# EAGLE board control_board (EAGLE 9.6.2)
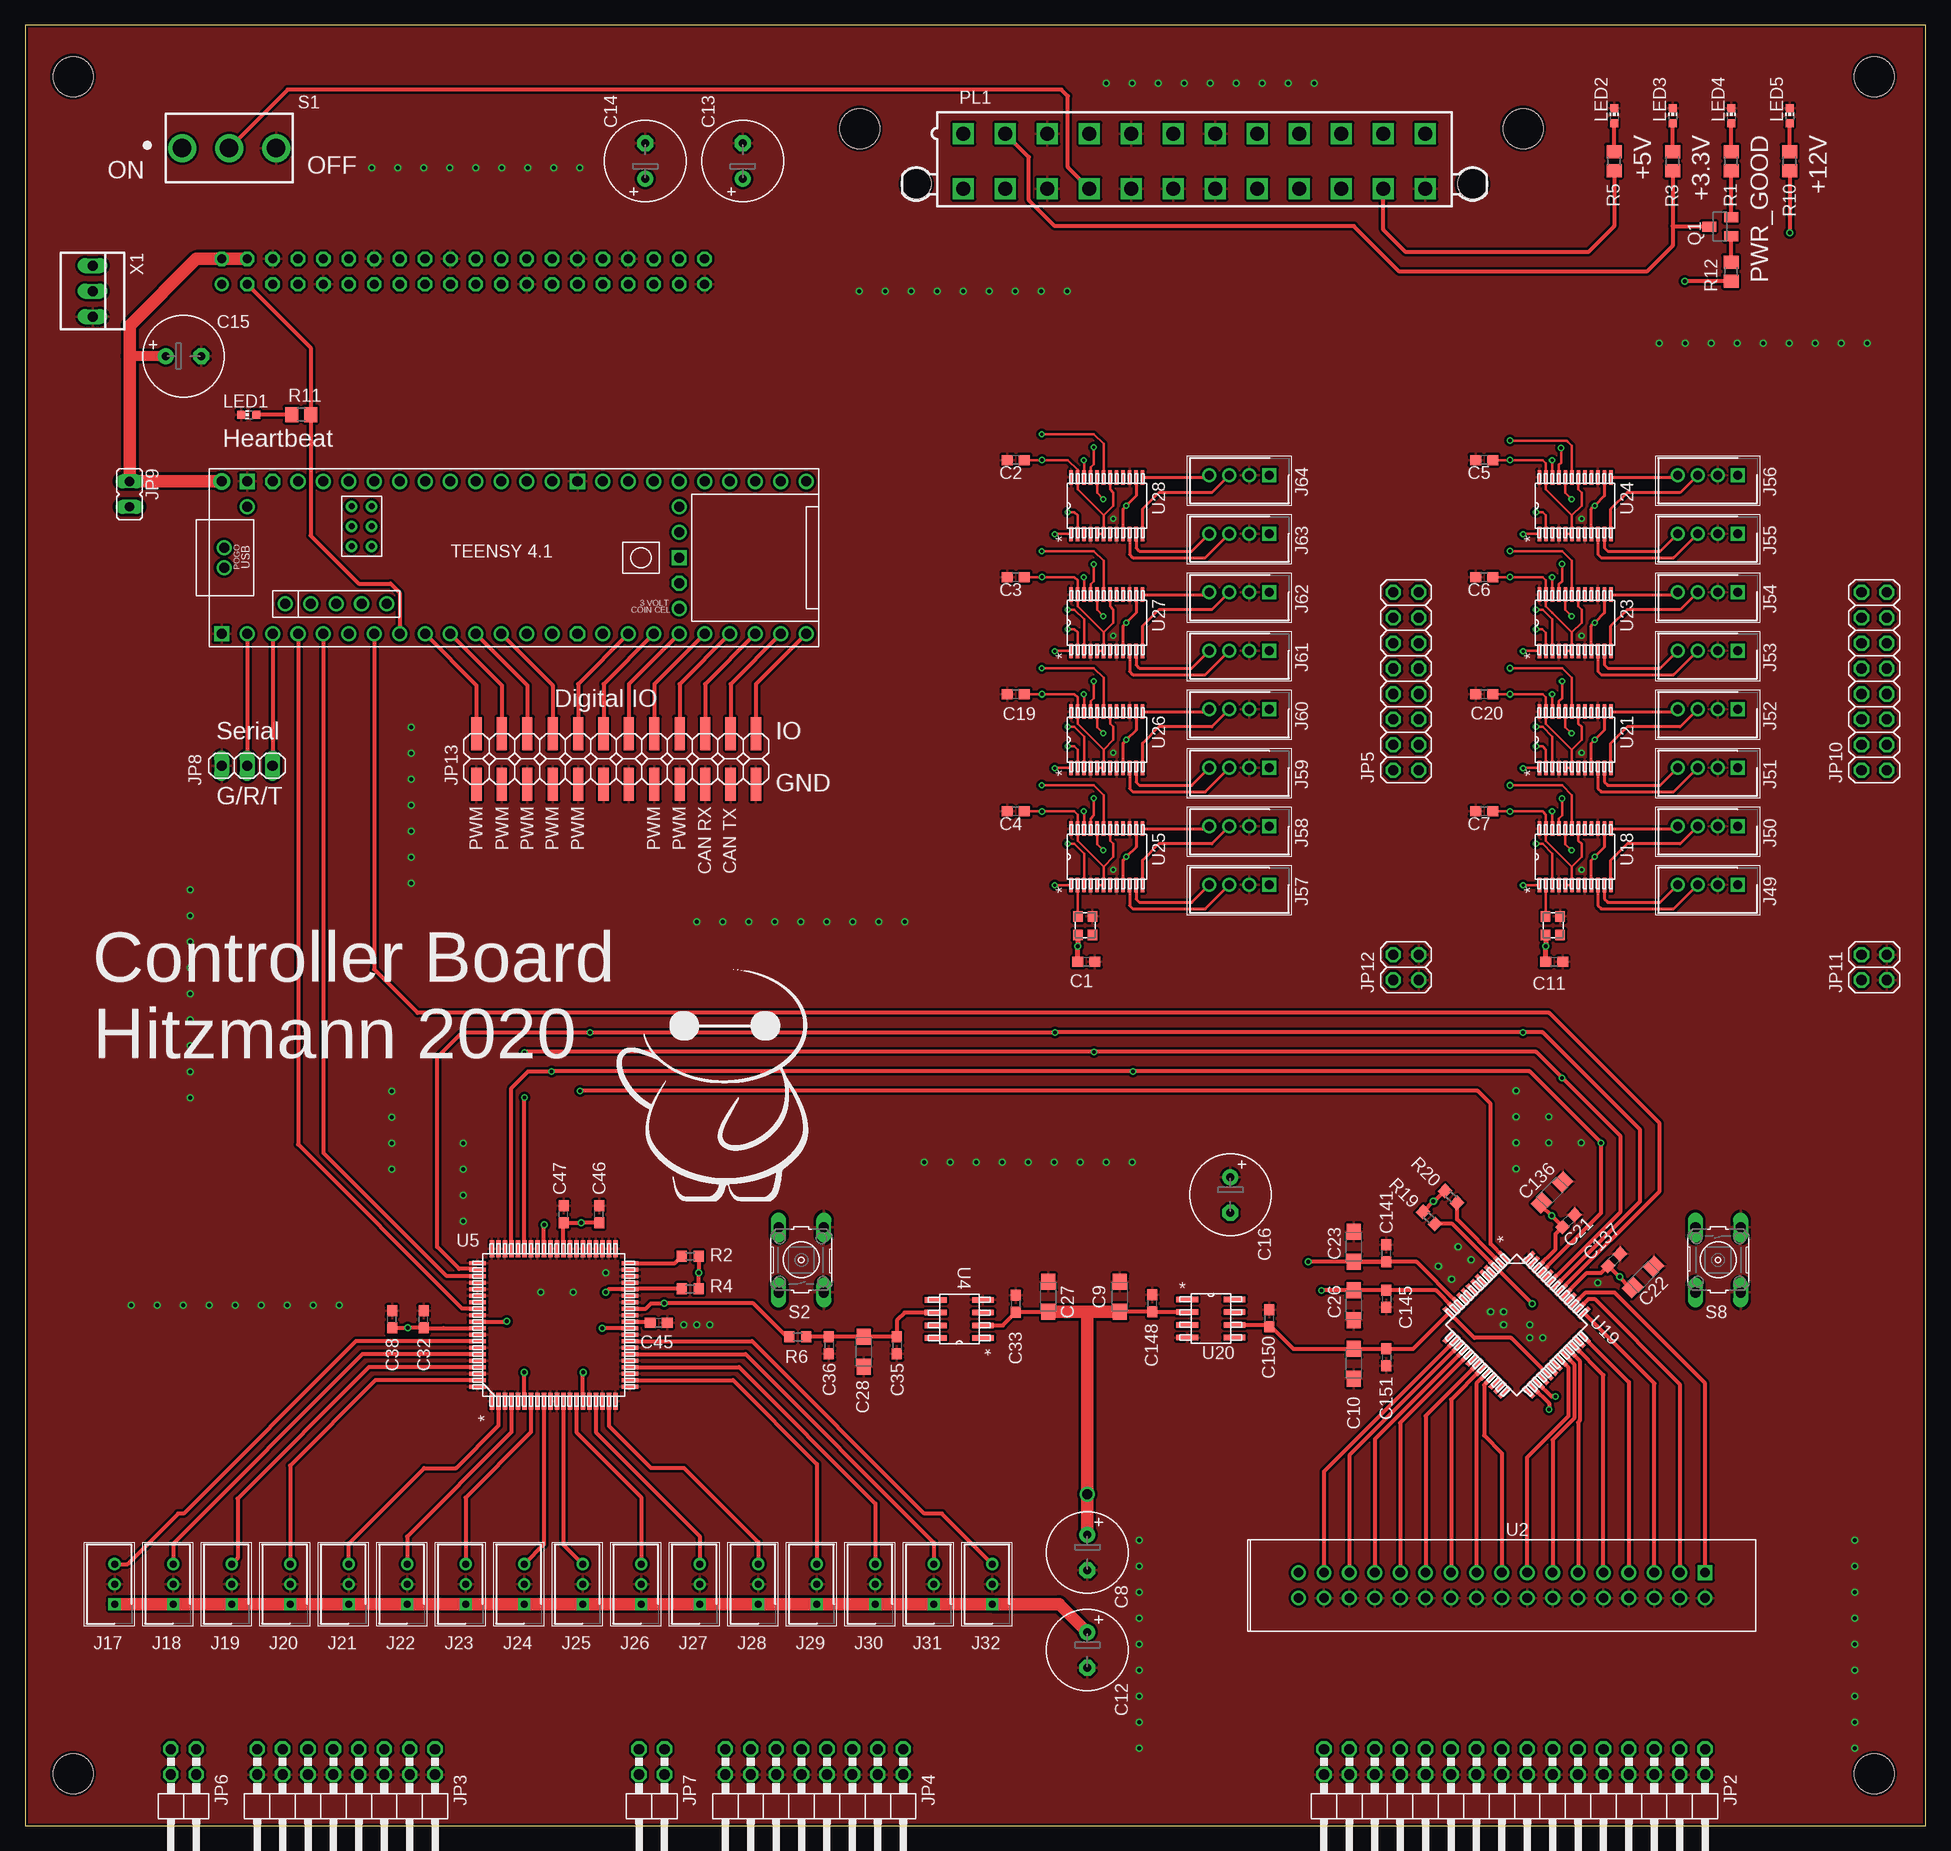
[diagram p6: board, top side]
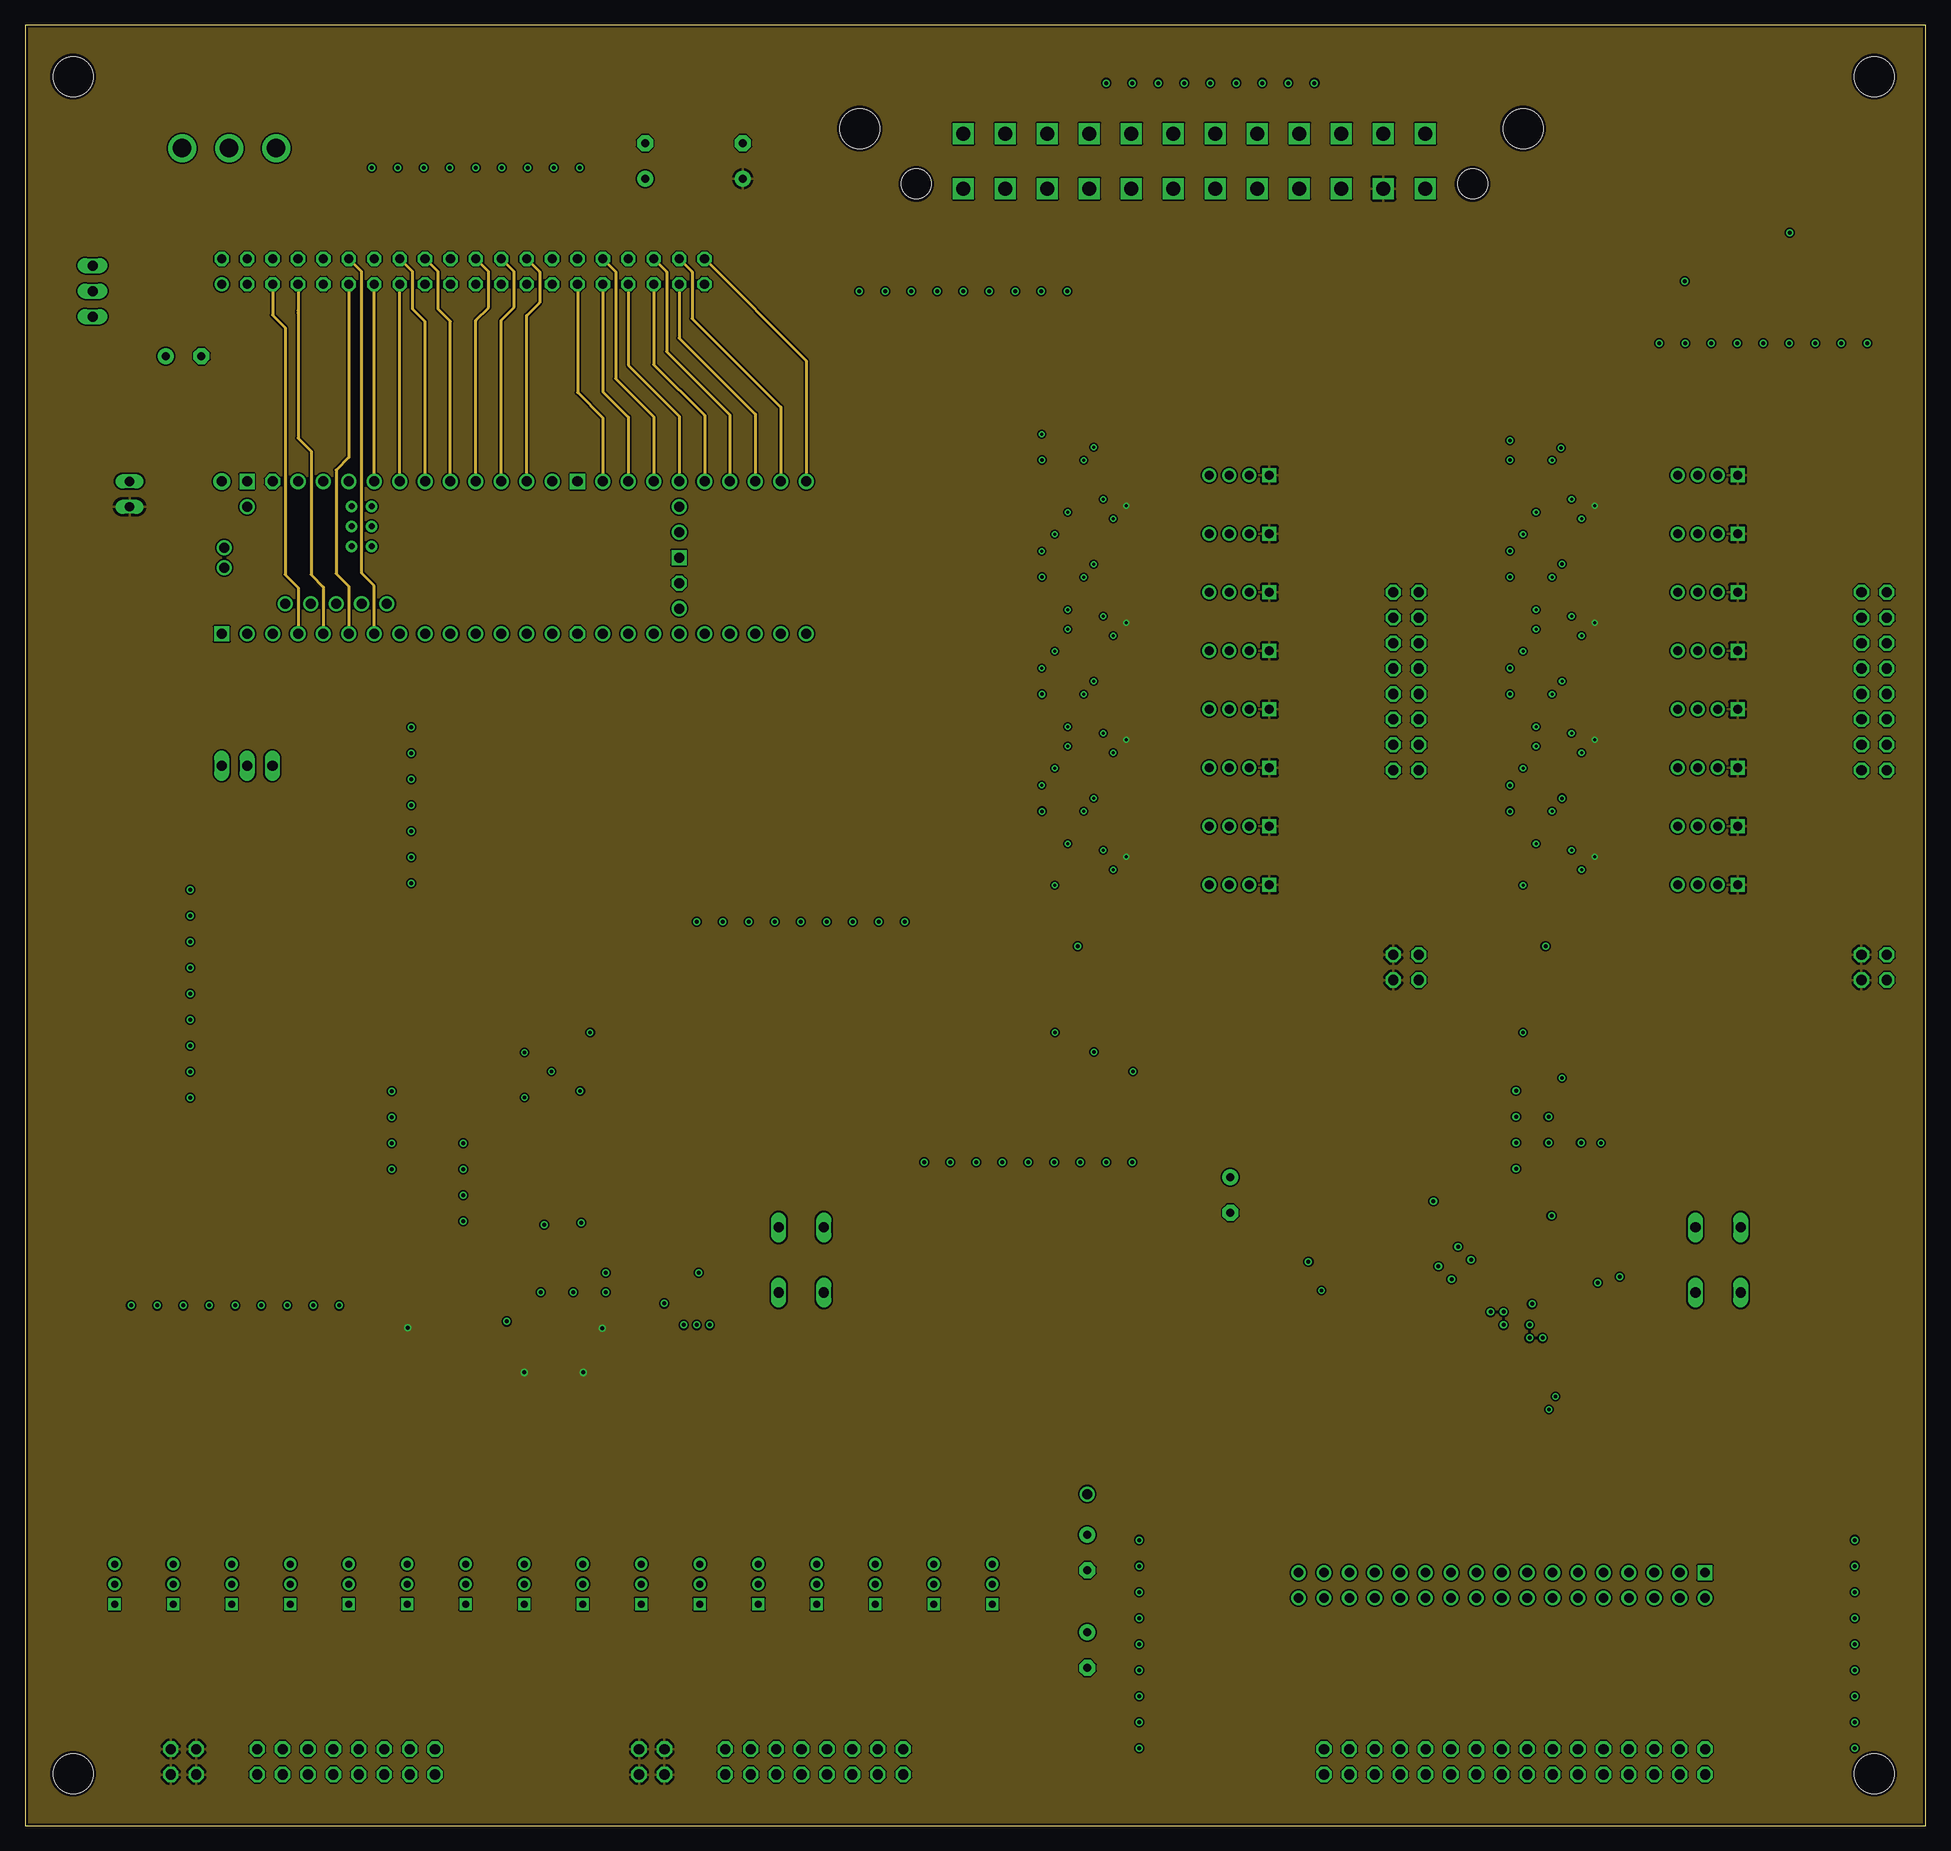
[diagram p7: board, inner layer Route2]
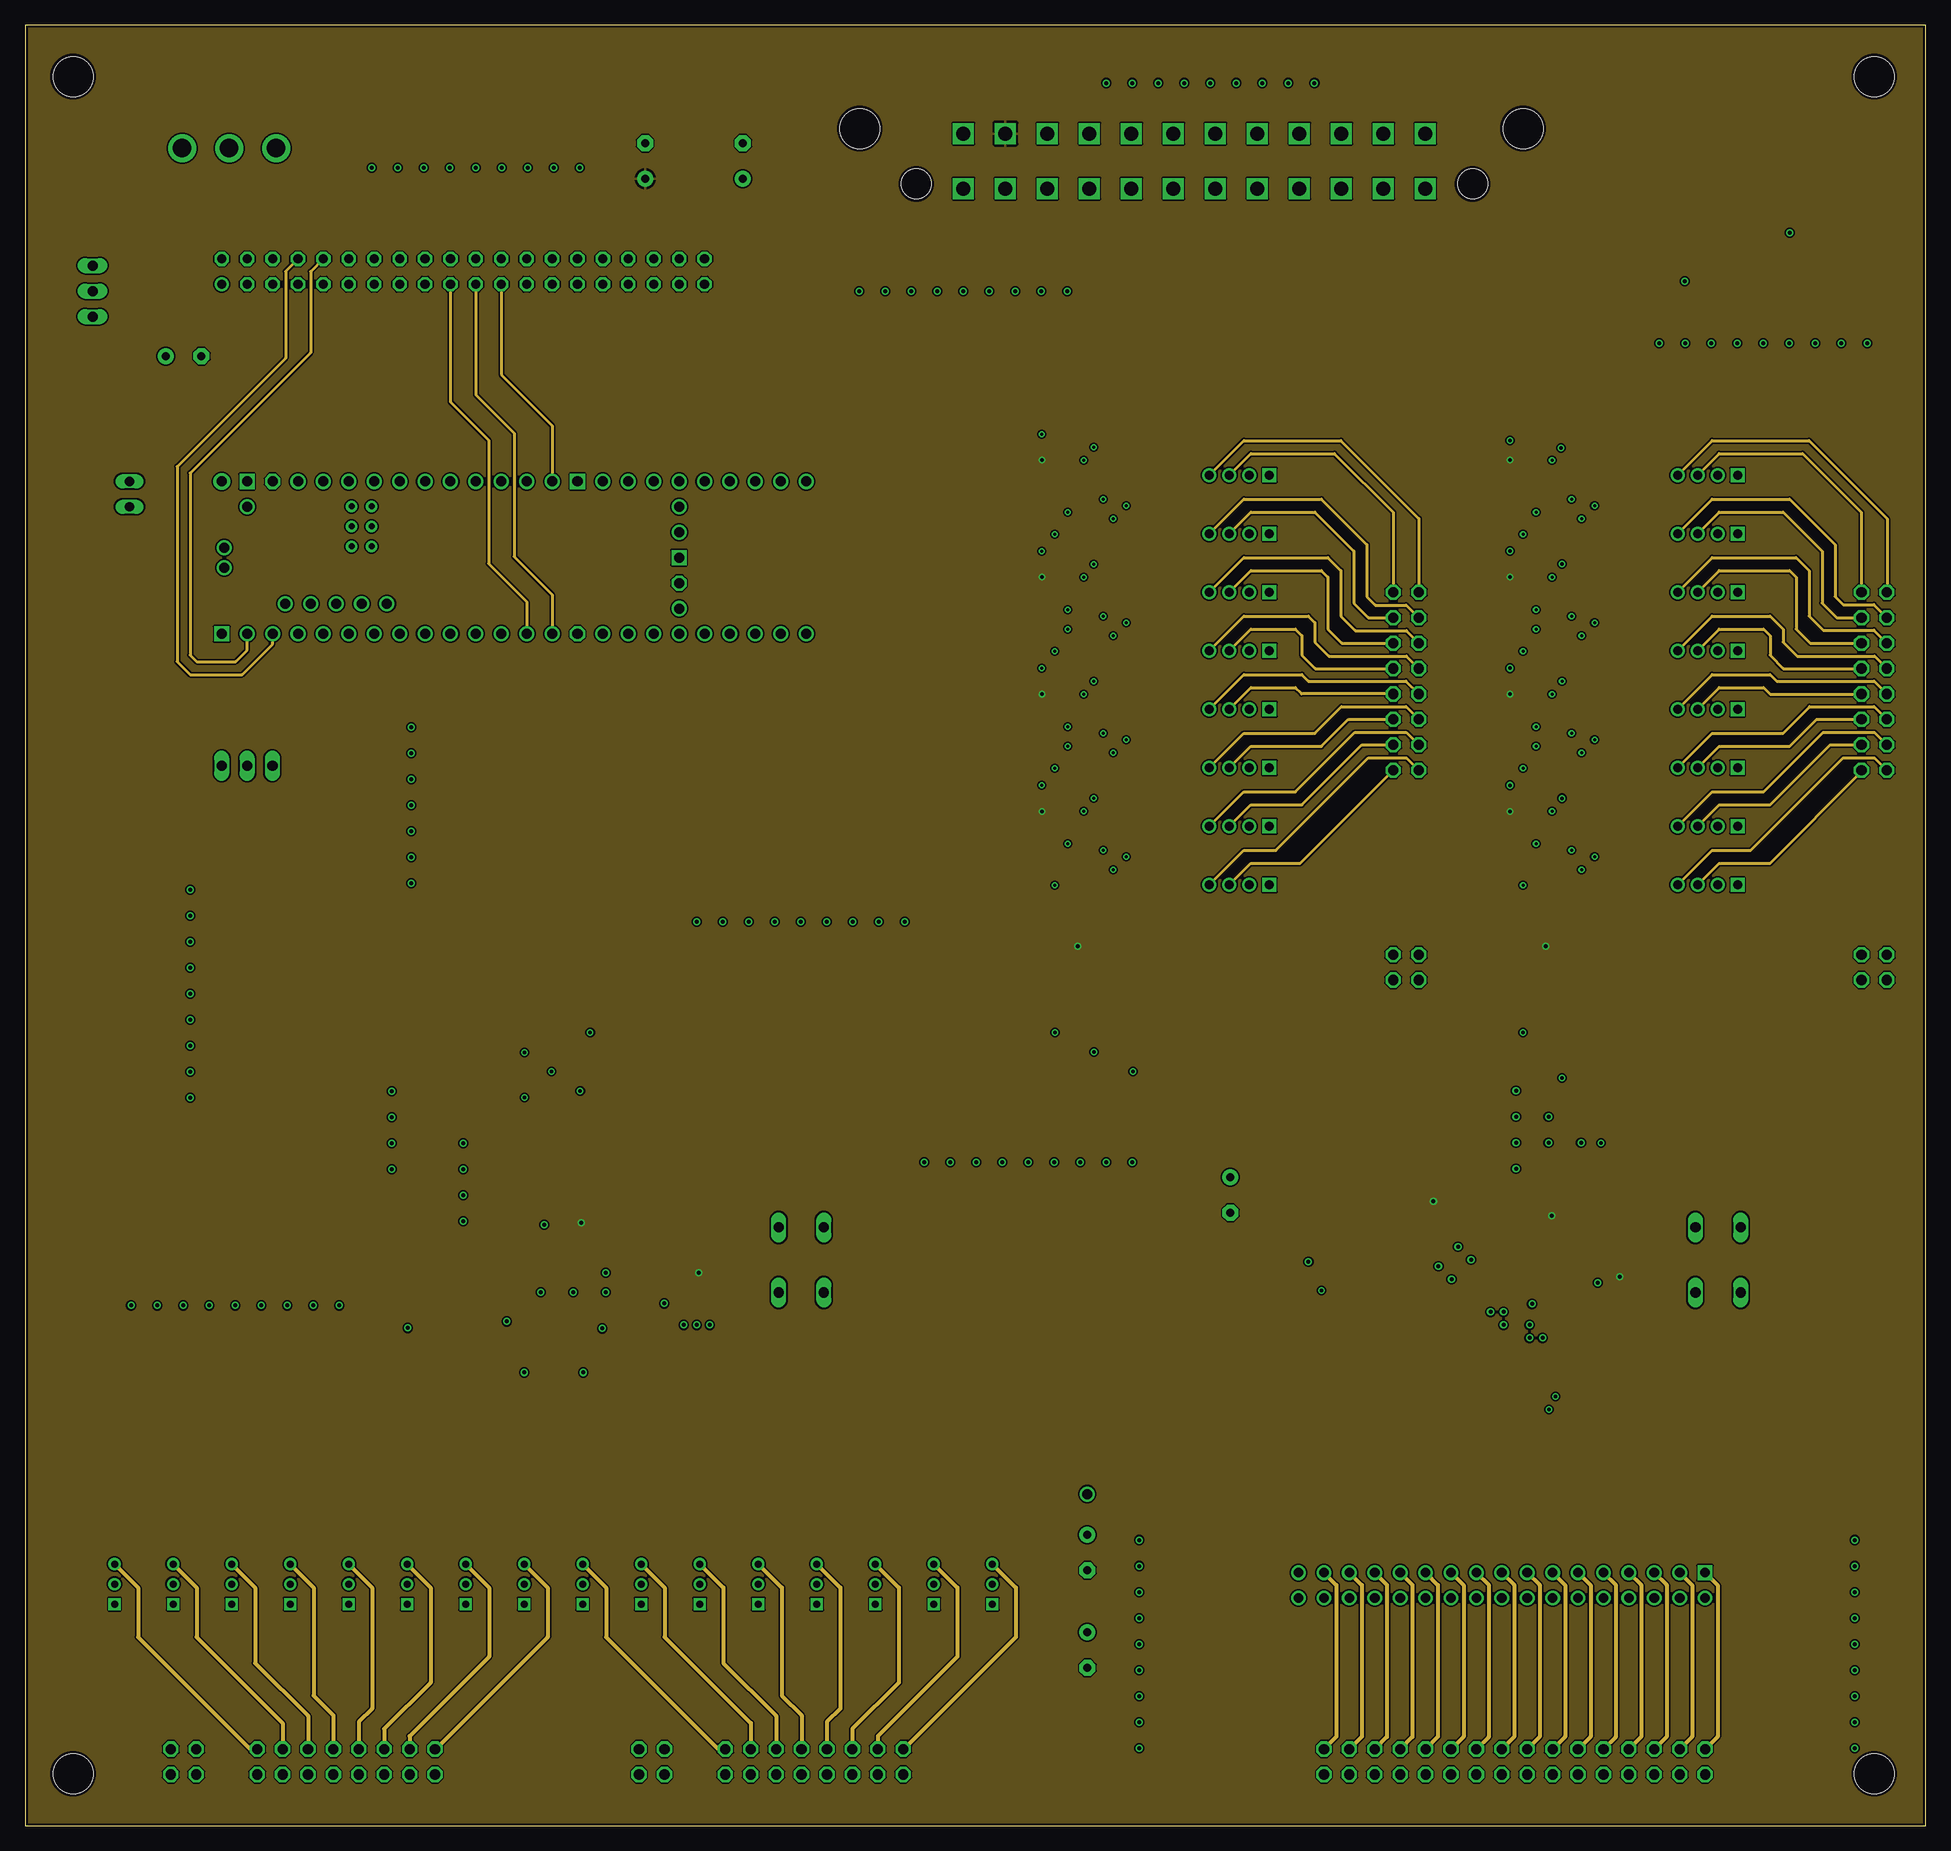
[diagram p8: board, inner layer Route15]
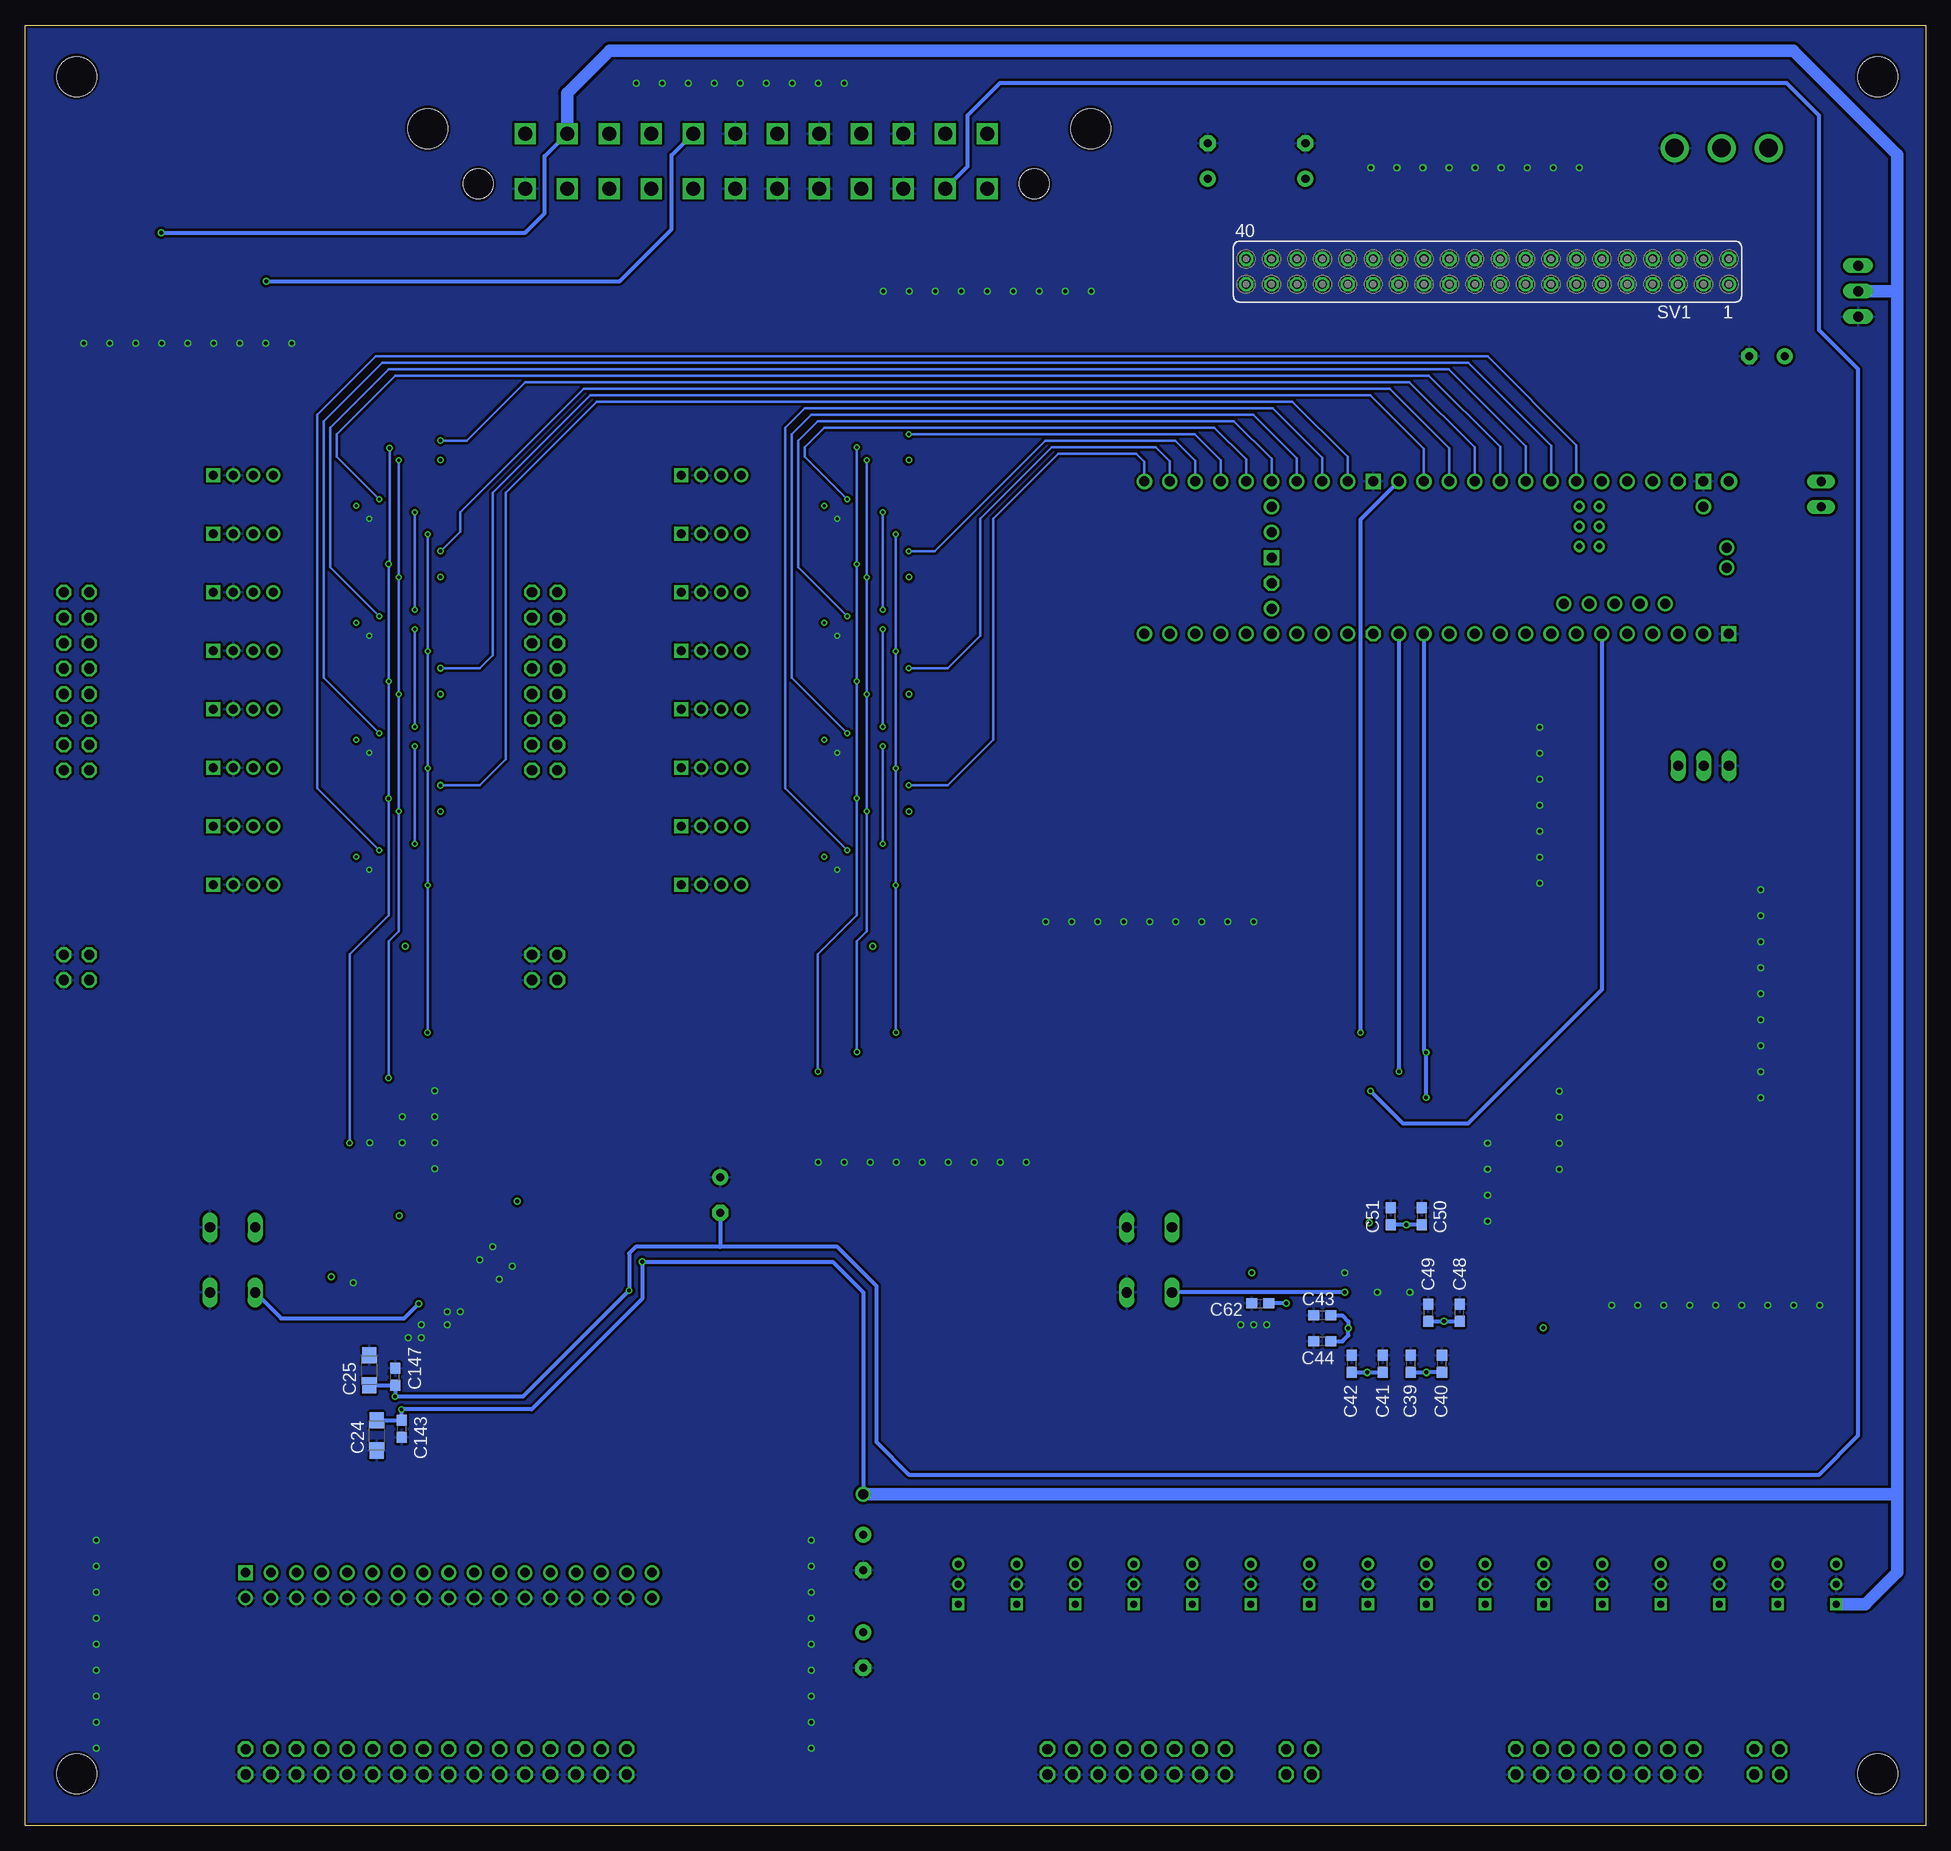
[diagram p9: board, bottom side, seen from below]

Size 190 x 180 mm. Coordinates in mm from the lower left corner, seen from the top.
Outline: 0,0 190,0 190,180 0,180 0,0
Copper layers (1+2*15+16): Top 0.035mm / dielectric 1.5mm / Route2 0.0175mm / dielectric 1.1mm / Route15 0.0175mm / dielectric 0.2mm / Bottom 0.035mm
Design rules "dirt_cheap_dirty_boards.v1.1 *": minimum track width 6mil, minimum drill 12mil, track to track 6mil, track to pad 6mil, pad to pad 6mil, via to via 6mil, smd to smd 0mil, copper to edge 10mil, drill to drill 10mil, minimum pad ring 10mil, minimum via ring 6mil, stop-mask expansion 2mil, vias tented up to drill 25mil, thermal gap 10mil
Holes 4 mm at 4.8,174.85 83.45,169.65 149.75,169.65 184.85,174.85 184.85,5.2 4.8,5.2

## Footprints (pad centres in the part's own frame; a part is rotated, then mirrored left to right if it is on the bottom)
C0603 = smd 1.1 x 1: 1 -0.85,0; 2 0.85,0
E3,5-8 = drill 0.813 pad 1.6: + -1.778,0 | drill 0.813 pad 1.6 octagon: - 1.778,0
SMC_A = smd 1.6 x 1.4: + -1.5,0; - 1.5,0
JST_PH_SHDR3W50P0X200_1X3_790X450X600 = drill 0.7 pad 1.1 square: 1 0,0 | drill 0.7 pad 1.1: 2 2,0; 3 4,0
SHDR4W50P0X200_1X4_990X450X600 = drill 0.9 pad 1.35 square: 1 0,0 | drill 0.9 pad 1.35: 2 2,0; 3 4,0; 4 6,0
2X16/90 = drill 1.016 octagon: 1 -19.05,-6.35; 2 -19.05,-3.81; 3 -16.51,-6.35; 4 -16.51,-3.81; 5 -13.97,-6.35; 6 -13.97,-3.81; 7 -11.43,-6.35; 8 -11.43,-3.81; 9 -8.89,-6.35; 10 -8.89,-3.81; 11 -6.35,-6.35; 12 -6.35,-3.81; 13 -3.81,-6.35; 14 -3.81,-3.81; 15 -1.27,-6.35; 16 -1.27,-3.81; 17 1.27,-6.35; 18 1.27,-3.81; 19 3.81,-6.35; 20 3.81,-3.81; 21 6.35,-6.35; 22 6.35,-3.81; 23 8.89,-6.35; 24 8.89,-3.81; 25 11.43,-6.35; 26 11.43,-3.81; 27 13.97,-6.35; 28 13.97,-3.81; 29 16.51,-6.35; 30 16.51,-3.81; 31 19.05,-6.35; 32 19.05,-3.81
2X08/90 = drill 1.016 octagon: 1 -8.89,-6.35; 2 -8.89,-3.81; 3 -6.35,-6.35; 4 -6.35,-3.81; 5 -3.81,-6.35; 6 -3.81,-3.81; 7 -1.27,-6.35; 8 -1.27,-3.81; 9 1.27,-6.35; 10 1.27,-3.81; 11 3.81,-6.35; 12 3.81,-3.81; 13 6.35,-6.35; 14 6.35,-3.81; 15 8.89,-6.35; 16 8.89,-3.81
2X08 = drill 1.016 octagon: 1 -8.89,-1.27; 2 -8.89,1.27; 3 -6.35,-1.27; 4 -6.35,1.27; 5 -3.81,-1.27; 6 -3.81,1.27; 7 -1.27,-1.27; 8 -1.27,1.27; 9 1.27,-1.27; 10 1.27,1.27; 11 3.81,-1.27; 12 3.81,1.27; 13 6.35,-1.27; 14 6.35,1.27; 15 8.89,-1.27; 16 8.89,1.27
2X02/90 = drill 1.016 octagon: 1 -1.27,-6.35; 2 -1.27,-3.81; 3 1.27,-6.35; 4 1.27,-3.81
1X03 = drill 1.016 long: 1 -2.54,0; 2 0,0; 3 2.54,0
JP1 = drill 0.914 long: 1 0,-1.27; 2 0,1.27
2X02 = drill 1.016 octagon: 1 -1.27,-1.27; 2 -1.27,1.27; 3 1.27,-1.27; 4 1.27,1.27
2X12SMD = smd 1.016 x 3.302: 1 -1.27,-3.81; 2 -1.27,1.27; 3 1.27,-3.81; 4 1.27,1.27; 5 3.81,-3.81; 6 3.81,1.27; 7 6.35,-3.81; 8 6.35,1.27; 9 8.89,-3.81; 10 8.89,1.27; 11 11.43,-3.81; 12 11.43,1.27; 13 13.97,-3.81; 14 13.97,1.27; 15 16.51,-3.81; 16 16.51,1.27; 17 19.05,-3.81; 18 19.05,1.27; 19 21.59,-3.81; 20 21.59,1.27; 21 24.13,-3.81; 22 24.13,1.27; 23 26.67,-3.81; 24 26.67,1.27
CHIP-LED0603 = smd 0.8 x 0.8: A 0,-0.75; C 0,0.75
5566-24 = drill 1.4 square: 1 23.1,-2.75; 2 18.9,-2.75; 3 14.7,-2.75; 4 10.5,-2.75; 5 6.3,-2.75; 6 2.1,-2.75; 7 -2.1,-2.75; 8 -6.3,-2.75; 9 -10.5,-2.75; 10 -14.7,-2.75; 11 -18.9,-2.75; 12 -23.1,-2.75; 13 23.1,2.75; 14 18.9,2.75; 15 14.7,2.75; 16 10.5,2.75; 17 6.3,2.75; 18 2.1,2.75; 19 -2.1,2.75; 20 -6.3,2.75; 21 -10.5,2.75; 22 -14.7,2.75; 23 -18.9,2.75; 24 -23.1,2.75 | hole 3: 27.8,2.29; -27.8,2.29
SOT23-BEC = smd 1 x 1.4: B -0.95,-1.1; C 0,1.1; E 0.95,-1.1
R0805 = smd 1.3 x 1.5: 1 -0.95,0; 2 0.95,0
R0603 = smd 1 x 1.1: 1 -0.85,0; 2 0.85,0
1MS1T1B1M2QES-5 = drill 1.85 pad 2.8: 1 0,-4.7; 2 0,0; 3 0,4.7
B3F-10XX = drill 1.016 long: 1 -3.251,2.261; 2 3.251,2.261; 3 -3.251,-2.261; 4 3.251,-2.261
FE20-2 = drill 0.914: 1 -24.13,1.27 | drill 0.914 octagon: 2 -24.13,-1.27; 3 -21.59,1.27; 4 -21.59,-1.27; 5 -19.05,1.27; 6 -19.05,-1.27; 7 -16.51,1.27; 8 -16.51,-1.27; 9 -13.97,1.27; 10 -13.97,-1.27; 11 -11.43,1.27; 12 -11.43,-1.27; 13 -8.89,1.27; 14 -8.89,-1.27; 15 -6.35,1.27; 16 -6.35,-1.27; 17 -3.81,1.27; 18 -3.81,-1.27; 19 -1.27,1.27; 20 -1.27,-1.27; 21 1.27,1.27; 22 1.27,-1.27; 23 3.81,1.27; 24 3.81,-1.27; 25 6.35,1.27; 26 6.35,-1.27; 27 8.89,1.27; 28 8.89,-1.27; 29 11.43,1.27; 30 11.43,-1.27; 31 13.97,1.27; 32 13.97,-1.27; 33 16.51,1.27; 34 16.51,-1.27; 35 19.05,1.27; 36 19.05,-1.27; 37 21.59,1.27; 38 21.59,-1.27; 39 24.13,1.27; 40 24.13,-1.27
AMP-5103309-7-34PIN_TYCO_5103309-7 = drill 0.965 square: 1 0,2.54 | drill 0.965: 2 0,0; 3 -2.54,2.54; 4 -2.54,0; 5 -5.08,2.54; 6 -5.08,0; 7 -7.62,2.54; 8 -7.62,0; 9 -10.16,2.54; 10 -10.16,0; 11 -12.7,2.54; 12 -12.7,0; 13 -15.24,2.54; 14 -15.24,0; 15 -17.78,2.54; 16 -17.78,0; 17 -20.32,2.54; 18 -20.32,0; 19 -22.86,2.54; 20 -22.86,0; 21 -25.4,2.54; 22 -25.4,0; 23 -27.94,2.54; 24 -27.94,0; 25 -30.48,2.54; 26 -30.48,0; 27 -33.02,2.54; 28 -33.02,0; 29 -35.56,2.54; 30 -35.56,0; 31 -38.1,2.54; 32 -38.1,0; 33 -40.64,2.54; 34 -40.64,0
R_8 = smd 2.184 x 0.559: 1 -2.362,1.905; 2 -2.362,0.635; 3 -2.362,-0.635; 4 -2.362,-1.905; 5 2.362,-1.905; 6 2.362,-0.635; 7 2.362,0.635; 8 2.362,1.905
ST_80_2 = smd 1.676 x 0.432: 1 -7.62,6.175; 2 -7.62,5.525; 3 -7.62,4.875; 4 -7.62,4.225; 5 -7.62,3.575; 6 -7.62,2.925; 7 -7.62,2.275; 8 -7.62,1.625; 9 -7.62,0.975; 10 -7.62,0.325; 11 -7.62,-0.325; 12 -7.62,-0.975; 13 -7.62,-1.625; 14 -7.62,-2.275; 15 -7.62,-2.925; 16 -7.62,-3.575; 17 -7.62,-4.225; 18 -7.62,-4.875; 19 -7.62,-5.525; 20 -7.62,-6.175; 41 7.62,-6.175; 42 7.62,-5.525; 43 7.62,-4.875; 44 7.62,-4.225; 45 7.62,-3.575; 46 7.62,-2.925; 47 7.62,-2.275; 48 7.62,-1.625; 49 7.62,-0.975; 50 7.62,-0.325; 51 7.62,0.325; 52 7.62,0.975; 53 7.62,1.625; 54 7.62,2.275; 55 7.62,2.925; 56 7.62,3.575; 57 7.62,4.225; 58 7.62,4.875; 59 7.62,5.525; 60 7.62,6.175 | smd 0.432 x 1.676: 21 -6.175,-7.62; 22 -5.525,-7.62; 23 -4.875,-7.62; 24 -4.225,-7.62; 25 -3.575,-7.62; 26 -2.925,-7.62; 27 -2.275,-7.62; 28 -1.625,-7.62; 29 -0.975,-7.62; 30 -0.325,-7.62; 31 0.325,-7.62; 32 0.975,-7.62; 33 1.625,-7.62; 34 2.275,-7.62; 35 2.925,-7.62; 36 3.575,-7.62; 37 4.225,-7.62; 38 4.875,-7.62; 39 5.525,-7.62; 40 6.175,-7.62; 61 6.175,7.62; 62 5.525,7.62; 63 4.875,7.62; 64 4.225,7.62; 65 3.575,7.62; 66 2.925,7.62; 67 2.275,7.62; 68 1.625,7.62; 69 0.975,7.62; 70 0.325,7.62; 71 -0.325,7.62; 72 -0.975,7.62; 73 -1.625,7.62; 74 -2.275,7.62; 75 -2.925,7.62; 76 -3.575,7.62; 77 -4.225,7.62; 78 -4.875,7.62; 79 -5.525,7.62; 80 -6.175,7.62
RU_24 = smd 1.473 x 0.356: 1 -2.819,3.575; 2 -2.819,2.925; 3 -2.819,2.275; 4 -2.819,1.625; 5 -2.819,0.975; 6 -2.819,0.325; 7 -2.819,-0.325; 8 -2.819,-0.975; 9 -2.819,-1.625; 10 -2.819,-2.275; 11 -2.819,-2.925; 12 -2.819,-3.575; 13 2.819,-3.575; 14 2.819,-2.925; 15 2.819,-2.275; 16 2.819,-1.625; 17 2.819,-0.975; 18 2.819,-0.325; 19 2.819,0.325; 20 2.819,0.975; 21 2.819,1.625; 22 2.819,2.275; 23 2.819,2.925; 24 2.819,3.575
ST_52 = smd 1.473 x 0.432: 1 -5.613,3.9; 2 -5.613,3.25; 3 -5.613,2.6; 4 -5.613,1.95; 5 -5.613,1.3; 6 -5.613,0.65; 7 -5.613,0; 8 -5.613,-0.65; 9 -5.613,-1.3; 10 -5.613,-1.95; 11 -5.613,-2.6; 12 -5.613,-3.25; 13 -5.613,-3.9; 27 5.613,-3.9; 28 5.613,-3.25; 29 5.613,-2.6; 30 5.613,-1.95; 31 5.613,-1.3; 32 5.613,-0.65; 33 5.613,0; 34 5.613,0.65; 35 5.613,1.3; 36 5.613,1.95; 37 5.613,2.6; 38 5.613,3.25; 39 5.613,3.9 | smd 0.432 x 1.473: 14 -3.9,-5.613; 15 -3.25,-5.613; 16 -2.6,-5.613; 17 -1.95,-5.613; 18 -1.3,-5.613; 19 -0.65,-5.613; 20 0,-5.613; 21 0.65,-5.613; 22 1.3,-5.613; 23 1.95,-5.613; 24 2.6,-5.613; 25 3.25,-5.613; 26 3.9,-5.613; 40 3.9,5.613; 41 3.25,5.613; 42 2.6,5.613; 43 1.95,5.613; 44 1.3,5.613; 45 0.65,5.613; 46 0,5.613; 47 -0.65,5.613; 48 -1.3,5.613; 49 -1.95,5.613; 50 -2.6,5.613; 51 -3.25,5.613; 52 -3.9,5.613
TEENSY41 = drill 1: 0-RX1/CS1/CRX2 -27.94,-7.62; 1-TX1/MISO1/CTX2 -25.4,-7.62; 2-OUT2 -22.86,-7.62; 3-LRCLK2 -20.32,-7.62; 4-BCLK2 -17.78,-7.62; 5-IN2 -15.24,-7.62; 6-OUT1D -12.7,-7.62; 7-RX2/OUT1A -10.16,-7.62; 8-TX2/IN2 -7.62,-7.62; 9-OUT1C -5.08,-7.62; 10-CS\MQSR -2.54,-7.62; 11-MOSI/CTX1 0,-7.62; 12-MISO/MQSL 2.54,-7.62; 13-SCK/LED 2.54,7.62; 14-A0/TX3/SPDIF_OUT 0,7.62; 15-A1/RX3/SPDIF_IN -2.54,7.62; 16-A2/RX4/SCL1 -5.08,7.62; 17-A3/TX4/SDA1 -7.62,7.62; 18-A4/SDA0 -10.16,7.62; 19-A5/SCL0 -12.7,7.62; 20-A6/TX5/LRCLK1 -15.24,7.62; 21-A7/RX5/BCLK1 -17.78,7.62; 22-A8/CTX1 -20.32,7.62; 23-A9/CRX1/MCLK1 -22.86,7.62; 24-A10/TX6/SCL2 7.62,-7.62; 25-A11/RX6/SDA2 10.16,-7.62; 26-A12/MOSI1 12.7,-7.62; 27-A13/SCK1 15.24,-7.62; 28-RX7 17.78,-7.62; 29-TX7 20.32,-7.62; 30-CRX3 22.86,-7.62; 31-CTX3 25.4,-7.62; 32-OUT1B 27.94,-7.62; 33-MCLK2 27.94,7.62; 34-RX8 25.4,7.62; 35-TX8 22.86,7.62; 36-PWM 20.32,7.62; 37-PWM 17.78,7.62; 38-A14/CS/IN1 15.24,7.62; 39-A15/CS/OUT1A 12.7,7.62; 40-A16/CS1 10.16,7.62; 41-A17/MISO1 7.62,7.62; +5V -24.13,-4.62; D+ -30.25,-1; D- -30.25,1; DM -21.59,-4.62; DP -19.05,-4.62; GND4 -16.51,-4.62; GND5 -13.97,-4.62; ON/OFF 15.24,5.08; PROGRAM 15.24,2.54; VBAT 15.24,-5.08; VUSB -27.94,5.08 | drill 1 octagon: 3V3-1 5.08,-7.62; 3V3-2 15.24,-2.54; 3V3-3 -25.4,7.62 | drill 0.6: G -15.51,3.12; LED -17.51,3.12; R+ -17.51,5.12; R- -15.51,5.12; T+ -15.51,1.12; T- -17.51,1.12 | drill 1 square: GND1 -30.48,-7.62; GND2 15.24,0; GND3 5.08,7.62; GND6 -27.94,7.62 | drill 1 pad 1.676: VIN -30.48,7.62
22-23-2031 = drill 1 long: 1 -2.54,0; 2 0,0; 3 2.54,0
KC2520B-C1 = smd 1.05 x 0.95: 1 0,-1.45; 2 1.85,-1.45; 3 1.85,0; 4 0,0

## Placement (x,y rotation side)
C1  100nF  [C0603]  106.1,86.35 180 top
C2  100nF  [C0603]  99.05,136.5 180 top
C3  100nF  [C0603]  99.05,124.8 180 top
C4  100nF  [C0603]  99.05,101.4 180 top
C5  100nF  [C0603]  145.85,136.5 180 top
C6  100nF  [C0603]  145.85,124.8 180 top
C7  100nF  [C0603]  145.85,101.4 180 top
C8  100uF  [E3,5-8]  106.2,27.3 270 top
C9  10uF  [SMC_A]  109.45,52.85 90 top
C10  10uF  [SMC_A]  132.85,46.15 270 top
C11  100nF  [C0603]  152.85,86.35 180 top
C12  100uF  [E3,5-8]  106.2,17.55 270 top
C13  100uF  [E3,5-8]  71.75,166.4 90 top
C14  100uF  [E3,5-8]  62,166.4 90 top
C15  100uF  [E3,5-8]  15.85,146.9 0 top
C16  100uF  [E3,5-8]  120.5,63.05 270 top
C19  100nF  [C0603]  99.05,113.1 180 top
C20  100nF  [C0603]  145.85,113.1 180 top
C21  10uF  [SMC_A]  152.65,63.3 45 top
C22  10uF  [SMC_A]  161.75,54.85 45 top
C23  10uF  [SMC_A]  132.85,57.85 90 top
C24  10uF  [SMC_A]  154.85,39 270 bottom
C25  10uF  [SMC_A]  155.6,45.5 270 bottom
C26  10uF  [SMC_A]  132.85,52 90 top
C27  10uF  [SMC_A]  102.3,52.85 90 top
C28  10uF  [SMC_A]  83.85,47.35 270 top
C32  100nF  [C0603]  39.85,50.6 90 top
C33  100nF  [C0603]  99.05,52.15 90 top
C35  100nF  [C0603]  87.15,48 270 top
C36  100nF  [C0603]  80.35,48 270 top
C38  10uF  [C0603]  36.7,50.6 90 top
C39  100nF  [C0603]  51.45,46.15 90 bottom
C40  10uF  [C0603]  48.35,46.15 90 bottom
C41  100nF  [C0603]  54.25,46.15 90 bottom
C42  10uF  [C0603]  57.35,46.15 90 bottom
C43  100nF  [C0603]  60.3,51 180 bottom
C44  10uF  [C0603]  60.3,48.4 180 bottom
C45  10uF  [C0603]  63.35,50.25 180 top
C46  100nF  [C0603]  57.4,61.1 90 top
C47  10uF  [C0603]  53.85,61.1 90 top
C48  100nF  [C0603]  46.6,51.25 90 bottom
C49  10uF  [C0603]  49.7,51.25 90 bottom
C50  10uF  [C0603]  50.35,60.9 90 bottom
C51  100nF  [C0603]  53.45,60.9 90 bottom
C62  100nF  [C0603]  66.5,52.2 0 bottom
C136  100nF  [C0603]  154.3,60.45 45 top
C137  100nF  [C0603]  158.85,56.55 45 top
C141  100nF  [C0603]  136.1,57.2 90 top
C143  100nF  [C0603]  152.35,39.65 270 bottom
C145  100nF  [C0603]  136.1,52.65 270 top
C147  100nF  [C0603]  153,44.85 90 bottom
C148  100nF  [C0603]  112.7,52.2 90 top
C150  100nF  [C0603]  124.4,50.7 90 top
C151  100nF  [C0603]  136.1,46.8 270 top
J17  JST_PH_B3B-PH-K-S(LF)(SN)  [JST_PH_SHDR3W50P0X200_1X3_790X450X600]  8.95,22.15 90 top
J18  JST_PH_B3B-PH-K-S(LF)(SN)  [JST_PH_SHDR3W50P0X200_1X3_790X450X600]  14.8,22.15 90 top
J19  JST_PH_B3B-PH-K-S(LF)(SN)  [JST_PH_SHDR3W50P0X200_1X3_790X450X600]  20.65,22.15 90 top
J20  JST_PH_B3B-PH-K-S(LF)(SN)  [JST_PH_SHDR3W50P0X200_1X3_790X450X600]  26.5,22.15 90 top
J21  JST_PH_B3B-PH-K-S(LF)(SN)  [JST_PH_SHDR3W50P0X200_1X3_790X450X600]  32.35,22.15 90 top
J22  JST_PH_B3B-PH-K-S(LF)(SN)  [JST_PH_SHDR3W50P0X200_1X3_790X450X600]  38.2,22.15 90 top
J23  JST_PH_B3B-PH-K-S(LF)(SN)  [JST_PH_SHDR3W50P0X200_1X3_790X450X600]  44.05,22.15 90 top
J24  JST_PH_B3B-PH-K-S(LF)(SN)  [JST_PH_SHDR3W50P0X200_1X3_790X450X600]  49.9,22.15 90 top
J25  JST_PH_B3B-PH-K-S(LF)(SN)  [JST_PH_SHDR3W50P0X200_1X3_790X450X600]  55.75,22.15 90 top
J26  JST_PH_B3B-PH-K-S(LF)(SN)  [JST_PH_SHDR3W50P0X200_1X3_790X450X600]  61.6,22.15 90 top
J27  JST_PH_B3B-PH-K-S(LF)(SN)  [JST_PH_SHDR3W50P0X200_1X3_790X450X600]  67.45,22.15 90 top
J28  JST_PH_B3B-PH-K-S(LF)(SN)  [JST_PH_SHDR3W50P0X200_1X3_790X450X600]  73.3,22.15 90 top
J29  JST_PH_B3B-PH-K-S(LF)(SN)  [JST_PH_SHDR3W50P0X200_1X3_790X450X600]  79.15,22.15 90 top
J30  JST_PH_B3B-PH-K-S(LF)(SN)  [JST_PH_SHDR3W50P0X200_1X3_790X450X600]  85,22.15 90 top
J31  JST_PH_B3B-PH-K-S(LF)(SN)  [JST_PH_SHDR3W50P0X200_1X3_790X450X600]  90.85,22.15 90 top
J32  JST_PH_B3B-PH-K-S(LF)(SN)  [JST_PH_SHDR3W50P0X200_1X3_790X450X600]  96.7,22.15 90 top
J49  [SHDR4W50P0X200_1X4_990X450X600]  171.2,94.05 180 top
J50  [SHDR4W50P0X200_1X4_990X450X600]  171.2,99.9 180 top
J51  [SHDR4W50P0X200_1X4_990X450X600]  171.2,105.75 180 top
J52  [SHDR4W50P0X200_1X4_990X450X600]  171.2,111.6 180 top
J53  [SHDR4W50P0X200_1X4_990X450X600]  171.2,117.45 180 top
J54  [SHDR4W50P0X200_1X4_990X450X600]  171.2,123.3 180 top
J55  [SHDR4W50P0X200_1X4_990X450X600]  171.2,129.15 180 top
J56  [SHDR4W50P0X200_1X4_990X450X600]  171.2,135 180 top
J57  [SHDR4W50P0X200_1X4_990X450X600]  124.4,94.05 180 top
J58  [SHDR4W50P0X200_1X4_990X450X600]  124.4,99.9 180 top
J59  [SHDR4W50P0X200_1X4_990X450X600]  124.4,105.75 180 top
J60  [SHDR4W50P0X200_1X4_990X450X600]  124.4,111.6 180 top
J61  [SHDR4W50P0X200_1X4_990X450X600]  124.4,117.45 180 top
J62  [SHDR4W50P0X200_1X4_990X450X600]  124.4,123.3 180 top
J63  [SHDR4W50P0X200_1X4_990X450X600]  124.4,129.15 180 top
J64  [SHDR4W50P0X200_1X4_990X450X600]  124.4,135 180 top
JP2  [2X16/90]  148.9,1.3 180 top
JP3  [2X08/90]  32.1,1.3 180 top
JP4  [2X08/90]  78.9,1.3 180 top
JP5  [2X08]  138.05,114.4 90 top
JP6  [2X02/90]  15.85,1.3 180 top
JP7  [2X02/90]  62.65,1.3 180 top
JP8  [1X03]  22.2,105.95 180 top
JP9  [JP1]  10.45,133.1 180 top
JP10  [2X08]  184.85,114.4 90 top
JP11  [2X02]  184.85,85.8 90 top
JP12  [2X02]  138.05,85.8 90 top
JP13  [2X12SMD]  46.4,107.9 0 top
LED1  [CHIP-LED0603]  22.35,141.05 90 top
LED2  [CHIP-LED0603]  158.85,170.95 0 top
LED3  [CHIP-LED0603]  164.7,170.95 0 top
LED4  [CHIP-LED0603]  170.55,170.95 0 top
LED5  [CHIP-LED0603]  176.4,170.95 0 top
PL1  [5566-24]  116.9,166.4 180 top
Q1  [SOT23-BEC]  169.45,159.85 90 top
R1  68  [R0805]  170.55,166.4 270 top
R2  10k  [R0603]  66.5,56.9 0 top
R3  68  [R0805]  164.7,166.4 270 top
R4  10k  [R0603]  66.5,53.65 0 top
R5  220  [R0805]  158.85,166.4 270 top
R6  10k  [R0603]  77.25,48.85 0 top
R10  680  [R0805]  176.4,166.4 270 top
R11  330  [R0805]  27.6,141.05 0 top
R12  1k  [R0805]  170.55,155.35 270 top
R19  100k  [R0603]  140.35,60.75 315 top
R20  100k  [R0603]  142.55,62.85 315 top
S1  [1MS1T1B1M2QES-5]  20.4,167.7 270 top
S2  [B3F-10XX]  77.6,56.55 90 top
S8  [B3F-10XX]  169.25,56.55 270 top
SV1  [FE20-2]  43.8,155.35 180 bottom
U2  [AMP-5103309-7-34PIN_TYCO_5103309-7]  167.95,22.75 0 top
U4  ADR421ARZ  [R_8]  93.4,50.65 180 top
U5  AD7616BSTZ  [ST_80_2]  52.85,50.05 90 top
U18  AD7730BRUZ  [RU_24]  154.95,96.85 90 top
U19  AD5360BSTZ  [ST_52]  149.1,50.05 315 top
U20  ADR425ARZ  [R_8]  118.55,50.7 0 top
U21  AD7730BRUZ  [RU_24]  154.95,108.55 90 top
U23  AD7730BRUZ  [RU_24]  154.95,120.25 90 top
U24  AD7730BRUZ  [RU_24]  154.95,131.95 90 top
U25  AD7730BRUZ  [RU_24]  108.15,96.85 90 top
U26  AD7730BRUZ  [RU_24]  108.15,108.55 90 top
U27  AD7730BRUZ  [RU_24]  108.15,120.25 90 top
U28  AD7730BRUZ  [RU_24]  108.15,131.95 90 top
U$1  TEENSY41  [TEENSY41]  50.15,126.75 0 top
X1  22-23-2031  [22-23-2031]  6.75,153.4 270 top
Y1  KC2520B-C1  [KC2520B-C1]  105.25,89.05 90 top
Y3  KC2520B-C1  [KC2520B-C1]  152,89.05 90 top

## Tracks (layer width: path | path; a pad name or v marks a point on that pad's centre or on a via)
+5V  (via drill 0.3, 0.4)
  Top 0.305: U24.9 156.57,131.62 v156.9,131.95 157.88,132.93 U24.14 | U23.9 156.57,119.92 v156.9,120.25 157.88,121.22 U23.14 | U21.9 156.57,108.22 v156.9,108.55 157.88,109.53 U21.14 | U18.9 156.57,96.53 v156.9,96.85 157.88,97.83 U18.14 | U28.9 109.78,131.62 v110.1,131.95 111.08,132.93 U28.14 | U27.9 109.78,119.92 v110.1,120.25 111.08,121.22 U27.14 | U26.9 109.78,108.22 v110.1,108.55 111.08,109.53 U26.14 | U25.9 109.78,96.53 v110.1,96.85 111.08,97.83 U25.14
  Top 0.406: U5.15 55.77,45.27 v55.8,45.3 | U5.30 57.73,49.73 v57.7,49.7 | U5.6 49.92,45.27 v49.9,45.3 | C38.1 v38.25,49.75 C32.1 39.87,49.73 41.83,49.73 U5.71 | R5.2 158.85,159.9 156.25,157.3 138.05,157.3 135.8,159.55 PL1.23
  Bottom 0.406: C41.1 v55.8,45.3 C42.1 | C44.1 58.3,48.4 57.7,49 v57.7,49.7 57.7,50.39 58.31,51 C43.1 | C40.1 v49.9,45.3 C39.1
  pour Route2: -2.35,-5.2 192.65,-5.2 192.65,182.65 -2.35,182.65
+5V_CURR_LIM
  Top 0.406: R5.1 LED2.A
ADC2_0
  Top 0.406: U5.28 72.67,48.42 89.9,31.2 91.65,31.2 J32.3
  Route15 0.406: J32.3 99.05,23.8 99.05,18.85 87.85,7.65 JP4.1
ADC2_1
  Top 0.406: U5.26 72.03,47.12 90.85,28.3 J31.3
  Route15 0.406: J31.3 93.2,23.8 93.2,16.9 85.25,8.95 JP4.3
ADC2_2
  Top 0.406: J30.3 85,32.2 71.38,45.83 U5.24
  Route15 0.406: J30.3 87.35,23.8 87.35,14.3 82.71,9.66 JP4.5
ADC2_3
  Top 0.406: J29.3 79.15,36.15 70.78,44.52 U5.22
  Route15 0.406: J29.3 81.5,23.8 81.5,11.7 80.17,10.37 JP4.7
ADC2_4
  Top 0.406: U5.19 58.38,39.98 62.6,35.75 65.9,35.75 73.3,28.35 J28.3
  Route15 0.406: J28.3 75.65,23.8 75.65,13 77.63,11.02 JP4.9
ADC2_5
  Top 0.406: U5.17 57.08,39.33 67.45,28.95 J27.3
  Route15 0.406: J27.3 69.8,23.8 69.8,16.25 75.09,10.96 JP4.11
ADC2_6
  Top 0.406: U5.14 55.12,39.33 61.6,32.85 J26.3
  Route15 0.406: J26.3 63.95,23.8 63.95,18.85 72.55,10.25 JP4.13
ADC2_7
  Top 0.406: J25.3 53.83,28.07 U5.12
  Route15 0.406: J25.3 58.1,23.8 58.1,18.85 69.3,7.65 JP4.15
ADC2_8
  Top 0.406: U5.73 33.08,48.42 15.85,31.2 15.3,31.2 10.25,26.15 J17.3
  Route15 0.406: J17.3 11.3,23.8 11.3,18.85 22.5,7.65 JP3.15
ADC2_9
  Top 0.406: U5.75 33.73,47.12 14.8,28.2 J18.3
  Route15 0.406: J18.3 17.15,23.8 17.15,18.85 25.75,10.25 JP3.13
ADC2_10
  Top 0.406: U5.77 34.38,45.83 21.25,32.7 21.25,26.75 J19.3
  Route15 0.406: J19.3 23,23.8 23,16.25 28.29,10.96 JP3.11
ADC2_11
  Top 0.406: U5.79 35.02,44.52 26.5,36 J20.3
  Route15 0.406: J20.3 28.85,23.8 28.85,13 30.83,11.02 JP3.9
ADC2_12
  Top 0.406: U5.2 47.33,39.98 43.1,35.75 39.9,35.75 32.35,28.2 J21.3
  Route15 0.406: J21.3 34.7,23.8 34.7,11.7 33.37,10.37 JP3.7
ADC2_13
  Top 0.406: U5.4 48.62,39.33 38.2,28.9 J22.3
  Route15 0.406: J22.3 40.55,23.8 40.55,14.3 35.91,9.66 JP3.5
ADC2_14
  Top 0.406: U5.7 50.58,39.33 44.05,32.8 J23.3
  Route15 0.406: J23.3 46.4,23.8 46.4,16.9 38.45,8.95 JP3.3
ADC2_15
  Top 0.406: U5.9 51.88,28.12 J24.3
  Route15 0.406: J24.3 52.25,23.8 52.25,18.85 41.05,7.65 JP3.1
ADC_2_COM_MODE
  Top 0.406: U5.40 64.97,56.23 R2.1
ADC_2_CONVST
  Top 0.406: U5.68 43.73,51.67 27.29,68.11 U$1.2-OUT2
  Route2 0.305: SV1.5 24.75,151 26,149.75 26,125.05 27.29,123.76 U$1.2-OUT2
ADC_2_REFCAP
  Top 0.406: U5.31 62.5,50.38 C45.2
ADC_2_REFINOUT  (via drill 0.4)
  Top 0.406: U5.33 62.08,51.67 62.6,52.2 v63.9,52.2 72.8,52.2 76.15,48.85 R6.1
  Bottom 0.406: v63.9,52.2 C62.2
ADC_2_REGCAP  (via drill 0.4)
  Top 0.406: U5.70 48.12,50.38 v48.15,50.4
  Bottom 0.406: C49.1 v48.15,50.4 C48.1
ADC_2_REGCAPD  (via drill 0.4)
  Top 0.406: U5.52 51.88,60.02 v51.9,60.05
  Bottom 0.406: C51.1 v51.9,60.05 C50.1
ADC_2_RST  (via drill 0.4)
  Top 0.406: R4.1 60.49,53.65 U5.36 58.38,53.62 v58.05,53.3
  Bottom 0.406: S2.1 v58.05,53.3
ADC_2_VREF
  Top 0.406: U4.6 87.94,51.28 87.15,50.5 C35.1 C28.+ C36.1 R6.2
BT_1_AIN1_+
  Top 0.305: U18.10 157.22,91.97 157.55,91.65 164.8,91.65 J49.3
  Route15 0.305: J49.3 169.35,96.2 174.45,96.2 183.58,105.33 JP10.2
BT_1_AIN1_-
  Top 0.305: U18.11 157.88,92.62 158.2,92.3 163.45,92.3 J49.4
  Route15 0.305: J49.4 168.65,97.5 172.5,97.5 180.3,105.3 181.75,106.75 184.88,106.75 JP10.1
BT_1_AIN2_+
  Top 0.305: J50.3 165.45,98.15 160.15,98.15 158.53,96.53 U18.12
  Route15 0.305: J50.3 169.35,102.05 174.45,102.05 180.45,108.05 JP10.4
BT_1_AIN2_-
  Top 0.305: U18.13 164.97,99.67 J50.4
  Route15 0.305: J50.4 168.65,103.35 173.8,103.35 179.75,109.3 184.87,109.3 JP10.3
BT_1_MCLK_OUT  (via drill 0.3)
  Top 0.254: U18.3 152.68,97.17 151.7,98.15 v151.05,98.15 | v151.05,107.9 151.7,107.9 152.03,107.58 U21.2
  Bottom 0.254: v151.05,98.15 v151.05,107.9
BT_2_AIN1_+
  Top 0.305: U21.10 157.22,103.67 157.55,103.35 164.8,103.35 J51.3
  Route15 0.305: J51.3 169.35,107.9 176.4,107.9 179.09,110.59 JP10.6
BT_2_AIN1_-
  Top 0.305: U21.11 157.88,104.33 158.2,104 163.45,104 J51.4
  Route15 0.305: J51.4 168.65,109.2 175.75,109.2 178.4,111.85 184.86,111.85 JP10.5
BT_2_AIN2_+
  Top 0.305: J52.3 165.45,109.85 160.15,109.85 158.53,108.22 U21.12
  Route15 0.305: J52.3 169.35,113.75 173.8,113.75 174.45,113.1 183.55,113.1 JP10.8
BT_2_AIN2_-
  Top 0.305: U21.13 164.97,111.37 J52.4
  Route15 0.305: J52.4 168.65,115.05 174.45,115.05 175.1,114.4 184.85,114.4 JP10.7
BT_2_MCLK_OUT  (via drill 0.3)
  Top 0.254: U21.3 152.68,108.88 151.7,109.85 v151.05,109.85 | v151.05,119.6 151.65,119.6 152.03,119.22 U23.2
  Bottom 0.254: v151.05,109.85 v151.05,119.6
BT_3_AIN1_+
  Top 0.305: U23.10 157.22,115.38 157.55,115.05 164.8,115.05 J53.3
  Route15 0.305: J53.3 169.35,119.6 173.8,119.6 174.45,118.95 174.45,117 175.78,115.67 JP10.10
BT_3_AIN1_-
  Top 0.305: U23.11 157.88,116.03 158.2,115.7 163.45,115.7 J53.4
  Route15 0.305: J53.4 168.65,120.9 174.45,120.9 175.75,119.6 175.75,118.3 177.15,116.9 184.89,116.9 JP10.9
BT_3_AIN2_+
  Top 0.305: J54.3 165.45,121.55 160.15,121.55 158.53,119.92 U23.12
  Route15 0.305: J54.3 169.35,125.45 176.4,125.45 177.05,124.8 177.05,119.6 178.44,118.21 JP10.12
BT_3_AIN2_-
  Top 0.305: U23.13 164.97,123.07 J54.4
  Route15 0.305: J54.4 168.65,126.75 177.05,126.75 178.35,125.45 178.35,120.9 179.75,119.5 184.83,119.5 JP10.11
BT_3_MCLK_OUT  (via drill 0.3)
  Top 0.254: U23.3 152.68,120.58 151.7,121.55 v151.05,121.55 | v151.05,131.3 151.7,131.3 152.03,130.97 U24.2
  Bottom 0.254: v151.05,121.55 v151.05,131.3
BT_4_AIN1_+
  Top 0.305: U24.10 157.22,127.08 157.55,126.75 164.8,126.75 J55.3
  Route15 0.305: J55.3 169.35,131.3 175.75,131.3 179.65,127.4 179.65,122.2 181.1,120.75 JP10.14
BT_4_AIN1_-
  Top 0.305: U24.11 157.88,127.72 158.2,127.4 163.45,127.4 J55.4
  Route15 0.305: J55.4 168.65,132.6 176.4,132.6 180.95,128.05 180.95,122.85 181.75,122.05 184.82,122.05 JP10.13
BT_4_AIN2_+
  Top 0.305: J56.3 165.45,133.25 160.15,133.25 158.53,131.62 U24.12
  Route15 0.305: J56.3 169.35,137.15 177.7,137.15 183.58,131.27 JP10.16
BT_4_AIN2_-
  Top 0.305: U24.13 164.97,134.77 J56.4
  Route15 0.305: J56.4 168.65,138.45 178.35,138.45 186.15,130.65 186.15,123.32 JP10.15
BT_4_MCLK_OUT
  Top 0.254: U25.2 105.22,90.92 Y1.3
BT_5_AIN1_+
  Top 0.305: U25.10 110.42,91.97 110.75,91.65 118,91.65 J57.3
  Route15 0.305: J57.3 122.55,96.2 127.47,96.2 JP5.2
BT_5_AIN1_-
  Top 0.305: U25.11 111.08,92.62 111.4,92.3 116.65,92.3 J57.4
  Route15 0.305: J57.4 121.85,97.5 125.05,97.5 134.3,106.75 138.08,106.75 JP5.1
BT_5_AIN2_+
  Top 0.305: J58.3 118.65,98.15 113.35,98.15 111.72,96.53 U25.12
  Route15 0.305: J58.3 122.55,102.05 127.65,102.05 133.65,108.05 JP5.4
BT_5_AIN2_-
  Top 0.305: U25.13 118.17,99.67 J58.4
  Route15 0.305: J58.4 121.85,103.35 127,103.35 132.95,109.3 138.07,109.3 JP5.3
BT_5_MCLK_OUT  (via drill 0.3)
  Top 0.254: U25.3 105.88,97.17 104.9,98.15 v104.25,98.15 | U26.2 105.22,107.58 104.9,107.9 v104.25,107.9
  Bottom 0.254: v104.25,107.9 v104.25,98.15
BT_6_AIN1_+
  Top 0.305: U26.10 110.42,103.67 110.75,103.35 118,103.35 J59.3
  Route15 0.305: J59.3 122.55,107.9 129.6,107.9 132.29,110.59 JP5.6
BT_6_AIN1_-
  Top 0.305: U26.11 111.08,104.33 111.4,104 116.65,104 J59.4
  Route15 0.305: J59.4 121.85,109.2 128.95,109.2 131.6,111.85 138.06,111.85 JP5.5
BT_6_AIN2_+
  Top 0.305: J60.3 118.65,109.85 113.35,109.85 111.72,108.22 U26.12
  Route15 0.305: J60.3 122.55,113.75 127,113.75 127.62,113.13 JP5.8
BT_6_AIN2_-
  Top 0.305: U26.13 118.17,111.37 J60.4
  Route15 0.305: J60.4 121.85,115.05 127.65,115.05 128.3,114.4 138.05,114.4 JP5.7
BT_6_MCLK_OUT  (via drill 0.3)
  Top 0.254: U26.3 105.88,108.88 104.9,109.85 v104.25,109.85 | U27.2 105.22,119.28 104.9,119.6 v104.25,119.6
  Bottom 0.254: v104.25,119.6 v104.25,109.85
BT_7_AIN1_+
  Top 0.305: U27.10 110.42,115.38 110.75,115.05 118,115.05 J61.3
  Route15 0.305: J61.3 122.55,119.6 127,119.6 127.65,118.95 127.65,117 128.98,115.67 JP5.10
BT_7_AIN1_-
  Top 0.305: U27.11 111.08,116.03 111.4,115.7 116.65,115.7 J61.4
  Route15 0.305: J61.4 121.85,120.9 128.3,120.9 128.95,120.25 128.95,118.3 130.35,116.9 138.09,116.9 JP5.9
BT_7_AIN2_+
  Top 0.305: J62.3 118.65,121.55 113.35,121.55 111.72,119.92 U27.12
  Route15 0.305: J62.3 122.55,125.45 129.6,125.45 130.25,124.8 130.25,119.6 131.64,118.21 JP5.12
BT_7_AIN2_-
  Top 0.305: U27.13 118.17,123.07 J62.4
  Route15 0.305: J62.4 121.85,126.75 130.25,126.75 131.55,125.45 131.55,120.9 133,119.45 138.08,119.45 JP5.11
BT_7_MCLK_OUT  (via drill 0.3)
  Top 0.254: U27.3 105.88,120.58 104.9,121.55 v104.25,121.55 | U28.2 105.22,130.97 104.9,131.3 v104.25,131.3
  Bottom 0.254: v104.25,131.3 v104.25,121.55
BT_8_AIN1_+
  Top 0.305: U28.10 110.42,127.08 110.75,126.75 118,126.75 J63.3
  Route15 0.305: J63.3 122.55,131.3 128.95,131.3 132.85,127.4 132.85,122.2 134.3,120.75 JP5.14
BT_8_AIN1_-
  Top 0.305: U28.11 111.08,127.72 111.4,127.4 116.65,127.4 J63.4
  Route15 0.305: J63.4 121.85,132.6 129.6,132.6 134.15,128.05 134.15,122.85 135,122 138.07,122 JP5.13
BT_8_AIN2_+
  Top 0.305: J64.3 118.65,133.25 113.35,133.25 111.72,131.62 U28.12
  Route15 0.305: J64.3 122.55,137.15 130.9,137.15 136.78,131.27 JP5.16
BT_8_AIN2_-
  Top 0.305: U28.13 118.17,134.77 J64.4
  Route15 0.305: J64.4 121.85,138.45 131.55,138.45 139.35,130.65 139.35,123.32 JP5.15
D_IO_1
  Top 0.406: U$1.7-RX2/OUT1A 45.13,113.99 JP13.2
D_IO_2
  Top 0.406: U$1.8-TX2/IN2 47.67,113.99 JP13.4
D_IO_3
  Top 0.406: U$1.9-OUT1C 50.21,113.99 JP13.6
D_IO_4
  Top 0.406: U$1.10-CS\MQSR 52.75,113.99 JP13.8
D_IO_5
  Top 0.406: U$1.25-A11/RX6/SDA2 55.29,114.11 JP13.10
D_IO_6
  Top 0.406: U$1.26-A12/MOSI1 57.83,114.11 JP13.12
D_IO_7
  Top 0.406: U$1.27-A13/SCK1 60.37,114.11 JP13.14
D_IO_8
  Top 0.406: U$1.28-RX7 62.91,114.11 JP13.16
D_IO_9
  Top 0.406: U$1.29-TX7 65.45,114.11 JP13.18
D_IO_10
  Top 0.406: U$1.30-CRX3 67.99,114.11 JP13.20
D_IO_11
  Top 0.406: U$1.31-CTX3 70.53,114.11 JP13.22
D_IO_12
  Top 0.406: U$1.32-OUT1B 73.07,114.11 JP13.24
DAC2_0
  Top 0.406: U19.34 154.3,45.77 154.3,40.95 150.17,36.82 U2.15
  Route15 0.406: U2.15 151.4,24.06 151.4,8.88 JP2.15
DAC2_1
  Top 0.406: U2.13 152.71,38.57 154.86,40.72 154.86,46.13 U19.35
  Route15 0.406: U2.13 153.95,24.05 153.95,8.89 JP2.13
DAC2_2
  Top 0.406: U2.11 155.25,40.32 155.42,40.49 155.42,46.49 U19.36
  Route15 0.406: U2.11 156.5,24.04 156.5,8.9 JP2.11
DAC2_3
  Top 0.406: U2.9 157.79,45.04 U19.37
  Route15 0.406: U2.9 159,24.08 159,8.86 JP2.9
DAC2_4
  Top 0.406: U19.39 160.33,44.34 U2.7
  Route15 0.406: U2.7 161.55,24.07 161.55,8.87 JP2.7
DAC2_5
  Top 0.406: U2.5 162.87,44.22 U19.40
  Route15 0.406: U2.5 164.1,24.06 164.1,8.88 JP2.5
DAC2_6
  Top 0.406: U19.41 156.3,52.65 156.9,52.65 165.41,44.14 U2.3
  Route15 0.406: U2.3 166.65,24.05 166.65,8.89 JP2.3
DAC2_7
  Top 0.406: U2.1 167.95,44.2 158.85,53.3 156.03,53.3 U19.42
  Route15 0.406: U2.1 169.2,24.04 169.2,8.9 JP2.1
DAC2_8
  Top 0.406: U19.15 129.85,35.4 U2.31
  Route15 0.406: U2.31 131.1,24.04 131.1,8.9 JP2.31
DAC2_9
  Top 0.406: U19.16 132.39,37.02 U2.29
  Route15 0.406: U2.29 133.65,24.03 133.65,8.91 JP2.29
DAC2_10
  Top 0.406: U19.17 134.93,38.64 U2.27
  Route15 0.406: U2.27 136.15,24.07 136.15,8.87 JP2.27
DAC2_11
  Top 0.406: U19.18 137.47,40.26 U2.25
  Route15 0.406: U2.25 138.7,24.06 138.7,8.88 JP2.25
DAC2_12
  Top 0.406: U19.20 140.01,40.96 U2.23
  Route15 0.406: U2.23 141.25,24.05 141.25,8.89 JP2.23
DAC2_13
  Top 0.406: U19.21 142.55,42.58 U2.21
  Route15 0.406: U2.21 143.8,24.04 143.8,8.9 JP2.21
DAC2_14
  Top 0.406: U19.22 145.09,44.2 U2.19
  Route15 0.406: U2.19 146.3,24.08 146.3,8.86 JP2.19
DAC2_15
  Top 0.406: U19.23 145.85,44.04 145.85,39 147.63,37.22 U2.17
  Route15 0.406: U2.17 148.85,24.07 148.85,8.87 JP2.17
DAC_2_CLR
  Top 0.406: R20.2 143.15,60.59 U19.2
DAC_2_RST  (via drill 0.4)
  Top 0.406: v150.65,52.15 150.65,52.18 U19.3 142.68,60.15 R19.2
  Bottom 0.406: S8.4 164.39,50.7 152.1,50.7 v150.65,52.15
DVCC  (via drill 0.35, 0.4)
  Top 0.254: U18.5 U18.6 154.62,95.88 | 154.62,107.58 U21.6 U21.5 | U23.5 U23.6 154.62,119.28 | U24.5 U24.6 154.62,130.97 | U26.5 U26.6 107.83,107.58 | U25.5 U25.6 107.83,95.88 | U27.5 U27.6 107.83,119.28 | U28.5 U28.6 107.83,130.97 | U24.18 155.28,133.57 155.6,133.25 155.6,131.95 154.62,130.97 | U23.18 155.28,121.88 155.6,121.55 155.6,120.25 154.62,119.28 | U21.18 155.28,110.17 155.6,109.85 155.6,108.55 154.62,107.58 | U18.18 155.28,98.47 155.6,98.15 155.6,96.85 154.62,95.88 | 107.83,95.88 105.22,98.47 U25.23 105.22,101.08 104.9,101.4 v101.65,101.4 C4.1 | 107.83,107.58 105.22,110.17 U26.23 105.22,112.78 104.9,113.1 v101.65,113.1 C19.1 | 107.83,119.28 105.22,121.88 U27.23 105.22,124.47 104.9,124.8 v101.65,124.8 C3.1 | 107.83,130.97 105.22,133.57 U28.23 105.22,135.53 104.25,136.5 v101.65,136.5 C2.1 | U25.18 108.47,98.47 108.8,98.15 108.8,96.85 107.83,95.88 | U26.18 108.47,110.17 108.8,109.85 108.8,108.55 107.83,107.58 | U27.18 108.47,121.88 108.8,121.55 108.8,120.25 107.83,119.28 | U28.18 108.47,133.57 108.8,133.25 108.8,131.95 107.83,130.97 | 152.03,133.57 | 154.62,130.97 152.03,133.57 | 152.68,121.22 | 154.62,119.28 152.68,121.22 | 152.03,98.47 | 154.62,95.88 152.03,98.47 | 152.03,112.78 151.7,113.1 v148.45,113.1 C20.1 | 152.03,112.78 | 152.03,98.47 | 152.03,98.47 U18.23 152.03,101.08 151.7,101.4 v148.45,101.4 C7.1 | 152.03,133.57 | 152.03,133.57 U24.23 152.03,136.18 151.7,136.5 v148.45,136.5 C5.1 | C6.1 v148.45,124.8 151.7,124.8 152.03,124.47 U23.23 152.03,121.88 152.68,121.22 | U21.23 152.03,110.17 154.62,107.58 | 152.03,112.78 U21.23 | U21.23
  Top 0.406: U19.44 156.14,55.25 157.55,55.25 C137.1 159.35,54.85 | U19.50 153,57.63 153,59.15 C136.1 v152.6,60.95 | U5.49 53.83,60.23 C47.1 v55.6,60.25 C46.1 | R4.2 v67.35,55.25 R2.2 | R20.1 140.9,62.4 v140.8,62.4 R19.1 | v152.6,60.95 | C21.+ 151.59,61.96 v152.6,60.95 | 159.35,54.85 v159.4,54.85 | C22.+ 160.41,53.79 159.35,54.85 | R3.2 164.7,159.9 | 164.7,159.9 164.7,157.95 162.1,155.35 137.4,155.35 132.85,159.9 102.95,159.9 100.35,162.5 100.35,166.8 PL1.2 | Q1.C 164.75,159.85 164.7,159.9
  Top 0.508: C1.2 v105.25,87.9 Y1.4 | C11.2 v152,87.9 Y3.4
  pour Route15: -3,-7.15 193.95,-7.15 193.95,183.3 -3,183.3
DVCC_CURR_LIM
  Top 0.406: R3.1 LED3.A
GND  (via drill 0.3, 0.4)
  other vias: 58.05,55.25 51.55,53.3 54.8,53.3 31.4,52 26.2,52 144.55,56.55 142.6,54.6 143.25,57.85 141.3,55.9 147.8,50.05 150.4,50.05 157.2,54.25 65.85,50.05 67.15,50.05 68.45,50.05 149.05,68.25 152.3,68.25 155.55,68.25 149.05,70.85 152.3,70.85 149.05,73.45 149.05,65.65 147.8,51.35 150.4,48.75 151.7,48.75 146.5,51.35 28.8,52 23.6,52 21,52 18.4,52 15.8,52 13.2,52 10.6,52 16.5,93.55 16.5,88.35 16.5,90.95 16.5,85.75 16.5,83.15 16.5,80.55 16.5,77.95 16.5,75.35 16.5,72.75 87.95,90.35 82.75,90.35 85.35,90.35 80.15,90.35 77.55,90.35 74.95,90.35 72.35,90.35 69.75,90.35 67.15,90.35 108.8,95.55 108.8,107.25 108.8,118.95 108.8,130.65 155.6,130.65 155.6,118.95 155.6,107.25 155.6,95.55 104.2,153.4 99,153.4 101.6,153.4 96.4,153.4 93.8,153.4 91.2,153.4 88.6,153.4 86,153.4 83.4,153.4 128.9,174.2 123.7,174.2 126.3,174.2 121.1,174.2 118.5,174.2 115.9,174.2 113.3,174.2 110.7,174.2 108.1,174.2 110.7,66.3 105.5,66.3 108.1,66.3 102.9,66.3 100.3,66.3 97.7,66.3 95.1,66.3 92.5,66.3 89.9,66.3 111.4,28.55 111.4,23.35 111.4,25.95 111.4,20.75 111.4,18.15 111.4,15.55 111.4,12.95 111.4,10.35 111.4,7.75 182.9,28.55 182.9,23.35 182.9,25.95 182.9,20.75 182.9,18.15 182.9,15.55 182.9,12.95 182.9,10.35 182.9,7.75 55.45,165.75 50.25,165.75 52.85,165.75 47.65,165.75 45.05,165.75 42.45,165.75 39.85,165.75 37.25,165.75 34.65,165.75 184.15,148.2 178.95,148.2 181.55,148.2 176.35,148.2 173.75,148.2 171.15,148.2 168.55,148.2 165.95,148.2 163.35,148.2 38.6,109.8 38.6,104.6 38.6,107.2 38.6,102 38.6,99.4 38.6,96.8 38.6,94.2 36.65,73.4 36.65,70.8 36.65,68.2 36.65,65.6 43.8,68.2 43.8,65.6 43.8,63 43.8,60.4
  pour Top (isolate 0.254): -1.05,-1.95 -1.05,180.85 190.7,180.85 190.7,-1.95
  pour Bottom (isolate 0.254): -1.7,-3.9 -1.7,181.8 191.35,181.8 191.35,-3.9
HB_CURR_LIM
  Top 0.406: R11.1 LED1.A
HEARTBEAT
  Top 0.406: SV1.3 28.55,147.74 R11.2 28.55,128.95 33.35,124.15 36.55,124.15 37.45,123.25 U$1.6-OUT1D
LC_1_CS0  (via drill 0.35)
  Top 0.254: U18.19 154.62,103.03 153.65,104 | v148.45,104 153.65,104 | 153.65,104
  Route2 0.305: U$1.41-A17/MISO1 57.77,140.73 55.23,143.27 SV1.29
  Bottom 0.254: U$1.41-A17/MISO1 57.77,136.82 63.3,142.35 132.85,142.35 141.95,133.25 141.95,106.6 144.55,104 v148.45,104
LC_1_CS1  (via drill 0.35)
  Top 0.254: U21.19 154.62,114.72 153.65,115.7 | 153.65,115.7 | 153.65,115.7 v148.45,115.7
  Route2 0.305: SV1.26 51.45,155.32 51.45,152.25 50.15,150.95 U$1.14-A0/TX3/SPDIF_OUT
  Bottom 0.254: U$1.14-A0/TX3/SPDIF_OUT 50.15,137.65 55.5,143 133.5,143 143.25,133.25 143.25,117 144.55,115.7 v148.45,115.7
LC_1_CS2  (via drill 0.35)
  Top 0.254: U23.19 154.62,126.42 153.65,127.4 | v148.45,127.4 153.65,127.4 | 153.65,127.4
  Route2 0.305: SV1.24 48.9,155.33 48.9,151.8 47.61,150.51 U$1.15-A1/RX3/SPDIF_IN
  Bottom 0.254: U$1.15-A1/RX3/SPDIF_IN 47.61,137.71 53.55,143.65 134.15,143.65 146.5,131.3 146.5,129.35 v148.45,127.4
LC_1_CS3  (via drill 0.35)
  Top 0.254: U24.19 154.62,137.93 154.2,138.35 154.1,138.45 | 154.1,138.45 | 154.1,138.45 v148.45,138.45
  Route2 0.305: SV1.22 46.35,155.34 46.35,151.75 45.07,150.47 U$1.16-A2/RX4/SCL1
  Bottom 0.254: U$1.16-A2/RX4/SCL1 45.07,137.77 51.6,144.3 140,144.3 145.85,138.45 v148.45,138.45
LC_1_CS4  (via drill 0.3)
  Top 0.254: U25.19 107.83,103.03 106.85,104 v101.65,104
  Route2 0.305: U$1.33-MCLK2 78.09,146.46 SV1.40
  Bottom 0.254: v101.65,104 97.75,104 93.2,108.55 93.2,130.65 86.7,137.15 78.9,137.15 78.09,136.34 U$1.33-MCLK2
LC_1_CS5  (via drill 0.3)
  Top 0.254: U26.19 107.83,114.72 106.85,115.7 v101.65,115.7
  Route2 0.305: SV1.38 66.7,155.31 66.7,150.65 75.55,141.8 U$1.34-RX8
  Bottom 0.254: v101.65,115.7 97.75,115.7 94.5,118.95 94.5,130.65 87.35,137.8 76.95,137.8 75.55,136.4 U$1.34-RX8
LC_1_CS6  (via drill 0.3)
  Top 0.254: U27.19 107.83,126.42 106.85,127.4 v101.65,127.4
  Route2 0.305: U$1.35-TX8 73.01,141.09 65.39,148.71 SV1.37
  Bottom 0.254: v101.65,127.4 99.05,127.4 88,138.45 75,138.45 73.01,136.46 U$1.35-TX8
LC_1_CS7  (via drill 0.3)
  Top 0.254: U28.19 107.83,138.12 106.85,139.1 v101.65,139.1
  Route2 0.305: U$1.36-PWM 70.47,141.03 64.15,147.35 64.15,155.32 SV1.36
  Bottom 0.254: v101.65,139.1 73.05,139.1 70.45,136.5 70.47,136.48 U$1.36-PWM
LC_1_MCLK
  Top 0.254: U18.2 152.03,90.92 Y3.3
LC_1_RDY0  (via drill 0.3)
  Top 0.254: U18.20 153.97,98.12 v154.6,97.5
  Route2 0.305: U$1.20-A6/TX5/LRCLK1 SV1.13
  Bottom 0.254: v154.6,97.5 160.8,103.7 160.8,141.05 154.95,146.9 43.8,146.9 34.91,138.01 U$1.20-A6/TX5/LRCLK1
LC_1_RDY1  (via drill 0.3)
  Top 0.254: U21.20 153.97,109.83 v154.6,109.2
  Route2 0.305: U$1.19-A5/SCL0 SV1.15
  Bottom 0.254: v154.6,109.2 160.15,114.75 160.15,140.4 154.3,146.25 45.75,146.25 37.45,137.95 U$1.19-A5/SCL0
LC_1_RDY2  (via drill 0.3)
  Top 0.254: U23.20 153.97,121.53 v154.6,120.9
  Route2 0.305: SV1.16 38.75,155.32 38.75,151.6 39.99,150.36 U$1.18-A4/SDA0
  Bottom 0.254: v154.6,120.9 159.5,125.8 159.5,139.75 153.65,145.6 47.7,145.6 39.99,137.89 U$1.18-A4/SDA0
LC_1_RDY3  (via drill 0.3)
  Top 0.254: U24.20 153.97,133.22 v154.6,132.6
  Route2 0.305: SV1.18 41.3,155.31 41.3,151.6 42.53,150.37 U$1.17-A3/TX4/SDA1
  Bottom 0.254: v154.6,132.6 158.85,136.85 158.85,139.1 153,144.95 49.65,144.95 42.53,137.83 U$1.17-A3/TX4/SDA1
LC_1_RDY4  (via drill 0.3)
  Top 0.254: U25.20 107.17,98.12 v107.8,97.5
  Route2 0.305: U$1.40-A16/CS1 60.31,140.79 57.77,143.32 57.77,151.78 SV1.31
  Bottom 0.254: v107.8,97.5 114,103.7 114,139.75 112.05,141.7 65.25,141.7 60.31,136.76 U$1.40-A16/CS1
LC_1_RDY5  (via drill 0.3)
  Top 0.254: U26.20 107.17,109.83 v107.8,109.2
  Route2 0.305: SV1.32 59.05,155.34 59.05,144.65 62.85,140.85 U$1.39-A15/CS/OUT1A
  Bottom 0.254: v107.8,109.2 113.35,114.75 113.35,139.1 111.4,141.05 67.2,141.05 62.85,136.7 U$1.39-A15/CS/OUT1A
LC_1_RDY6  (via drill 0.3)
  Top 0.254: U27.20 107.17,121.53 v107.8,120.9
  Route2 0.305: U$1.38-A14/CS/IN1 65.39,140.91 60.31,145.99 SV1.33
  Bottom 0.254: v107.8,120.9 112.7,125.8 112.7,138.45 110.75,140.4 69.15,140.4 65.39,136.64 U$1.38-A14/CS/IN1
LC_1_RDY7  (via drill 0.3)
  Top 0.254: U28.20 107.17,133.22 v107.8,132.6
  Route2 0.305: U$1.37-PWM 67.93,140.97 62.85,146.05 SV1.35
  Bottom 0.254: v107.8,132.6 112.05,136.85 112.05,137.8 110.1,139.75 71.1,139.75 67.93,136.58 U$1.37-PWM
LDAC  (via drill 0.35)
  Top 0.406: U19.1 146.5,58.16 146.5,72.15 145.2,73.45 v55.5,73.45
  Route2 0.305: U$1.4-BCLK2 32.37,123.88 31.1,125.15 31.1,135.5 32.37,136.77 SV1.11
  Bottom 0.406: v55.5,73.45 52.25,70.2 45.75,70.2 32.37,83.58 U$1.4-BCLK2
MISO  (via drill 0.3, 0.35)
  Top 0.254: U18.21 153.32,100.67 153.65,101 v153.65,102.7 | v153.65,114.4 153.65,112.7 153.32,112.38 U21.21 | U23.21 153.32,124.08 153.65,124.4 v153.65,126.1 | U25.21 106.53,100.67 106.85,101 v106.85,102.7 | U26.21 106.53,112.38 106.85,112.7 v106.85,114.4 | U27.21 106.53,124.08 106.85,124.4 v106.85,126.1 | U28.21 106.53,135.78 106.85,136.1 v106.85,137.8 | U24.21 153.32,136.03 153.56,136.26 153.56,137.69 v153.55,137.7 | v153.65,102.7
  Top 0.406: U19.49 157.55,61.26 v157.55,68.25 150.4,75.4 v110.75,75.4 v52.65,75.4 50.3,75.4 48.62,73.72 U5.57
  Route15 0.305: SV1.21 45.07,143.03 48.9,139.2 48.9,126.85 52.69,123.06 U$1.12-MISO/MQSL
  Bottom 0.254: v106.85,137.8 v106.85,126.1 v106.85,114.4 v106.85,102.7 106.85,91 110.75,87.1 v110.75,75.4 | v157.55,68.25 157.55,87.1 153.65,91 v153.65,102.7 v153.65,114.4 v153.65,126.1 153.56,126.19 153.56,126.84 153.56,136.41 153.56,137.69 v153.55,137.7
  Bottom 0.406: U$1.12-MISO/MQSL 52.69,75.44 v52.65,75.4
MOSI  (via drill 0.3, 0.35)
  Top 0.254: U21.22 152.68,113.08 v152.65,113.1 | U23.22 152.68,124.78 v152.65,124.8 | U18.22 152.68,101.38 v152.65,101.4 | U25.22 105.88,101.38 v105.85,101.4 | U26.22 105.88,113.08 v105.85,113.1 | U27.22 105.88,124.78 v105.85,124.8 | U28.22 105.88,136.47 v105.85,136.5 | U24.22 152.68,136.47 v152.65,136.5
  Top 0.406: U19.47 159.5,61.37 159.5,68.9 v153.65,74.75 151.05,77.35 v106.85,77.35 50,77.35 v49.92,77.28 | U5.55 v49.92,72.8
  Route15 0.305: SV1.19 42.53,142.32 46.35,138.5 46.35,126.15 50.15,122.35 U$1.11-MOSI/CTX1
  Bottom 0.254: v105.85,136.5 v105.85,124.8 v105.85,113.1 v105.85,101.4 105.85,89.4 106.85,88.4 v106.85,77.35 | v152.65,136.5 v152.65,124.8 v152.65,113.1 v152.65,101.4 152.65,89.4 153.65,88.4 v153.65,74.75
  Bottom 0.406: v49.92,72.8 v49.92,77.28 | v49.92,77.28 49.95,77.3 | v49.92,77.28 50.15,77.5 U$1.11-MOSI/CTX1
PG_CURR_LIM
  Top 0.406: R1.1 LED4.A
PG_SIG
  Top 0.406: R12.1 Q1.B
POWER_GOOD  (via drill 0.4)
  Top 0.406: R12.2 v165.9,154.4
  Bottom 0.406: v165.9,154.4 130.55,154.4 125.35,159.6 125.35,167 PL1.8
POWER_GOOD_SUPP
  Top 0.406: Q1.E R1.2
PSU_ENABLE
  Top 0.406: PL1.16 104.25,165.8 104.25,172.9 103.6,173.55 26.25,173.55 S1.2
PWR
  Top 1.016: C15.+ 10.45,146.9
  Top 1.27: U$1.VIN JP9.1 10.45,146.9 10.45,149.95 17.12,156.62 SV1.2 SV1.4
RX
  Top 0.406: U$1.0-RX1/CS1/CRX2 JP8.2
  Route15 0.305: SV1.10 28.55,155.34 28.55,147.25 16.5,135.2 16.5,117 17.15,116.35 21.05,116.35 22.21,117.51 U$1.0-RX1/CS1/CRX2
SCLK  (via drill 0.3, 0.35)
  Top 0.254: U28.1 102.98,129.13 v102.95,129.1 | U27.1 102.98,117.43 v102.95,117.4 | U26.1 102.98,105.73 v102.95,105.7 | U25.1 102.98,94.03 v102.95,94 | U24.1 149.78,129.13 v149.75,129.1 | U23.1 149.78,117.43 v149.75,117.4 | U21.1 149.78,105.73 v149.75,105.7 | U18.1 149.78,94.03 v149.75,94
  Top 0.406: U19.46 161.45,62.4 161.45,69.55 151.7,79.3 v149.75,79.3 v102.95,79.3 v56.5,79.3 43.7,79.3 41.2,76.8 41.2,57.85 43.4,55.65 45.15,55.65 U5.62
  Route15 0.305: SV1.23 47.61,145.04 52.69,139.96 U$1.13-SCK/LED
  Bottom 0.254: v149.75,129.1 v149.75,117.4 v149.75,105.7 v149.75,94 v149.75,79.3 | v102.95,129.1 v102.95,117.4 v102.95,105.7 v102.95,94 v102.95,79.3
  Bottom 0.406: U$1.13-SCK/LED 56.5,130.56 v56.5,79.3
SS_ADC_2
  Top 0.406: U5.63 42.17,54.92 29.83,67.27 U$1.3-LRCLK2
  Route2 0.305: SV1.7 27.29,151.45 27.29,151.19 27.29,138.71 28.6,137.4 28.6,125.05 29.83,123.82 U$1.3-LRCLK2
SS_DAC_2
  Top 0.406: U19.45 163.4,63.43 163.4,70.2 152.35,81.25 39.25,81.25 34.91,85.59 U$1.5-IN2
  Route2 0.305: SV1.12 33.65,155.34 33.65,125.2 34.91,123.94 U$1.5-IN2
TX
  Top 0.406: U$1.1-TX1/MISO1/CTX2 JP8.1
  Route15 0.305: SV1.8 26.05,155.38 26.05,146.7 15.2,135.85 15.2,116.35 16.5,115.05 21.7,115.05 24.75,118.1 U$1.1-TX1/MISO1/CTX2
VDD  (via drill 0.35, 0.4, 1)
  Top 0.406: U19.28 152.35,42.2 v152.35,41.6 | C23.+ C141.1 v128.3,56.35 139.12,56.35 U19.11 | U20.2 112.72,51.34 C148.1 C9.+ | C27.+ 102.25,51.3 C33.1 97.77,50.02 U4.2 | R10.2 v176.4,159.25
  Top 1.27: J17.1 J18.1 J19.1 J20.1 J21.1 J22.1 J23.1 J24.1 J25.1 J26.1 J27.1 J28.1 J29.1 J30.1 J31.1 J32.1 103.38,22.15 C12.+ | C27.+ 106.2,51.35 | 106.2,51.35 C9.+ | 106.2,51.35 v106.2,33.15 C8.+
  Bottom 0.406: C24.+ C143.1 v152.35,41.6 139.35,41.6 128.3,52.65 v128.3,56.35 109.25,56.35 106.2,53.3 v106.2,33.15 | v176.4,159.25 140,159.25 138.05,161.2 138.05,166.9 PL1.11
  Bottom 1.27: J17.1 6.05,22.15 2.85,25.35 2.85,33.15 | v106.2,33.15 2.85,33.15 | PL1.11 135.8,173.2 131.55,177.45 13.25,177.45 2.85,167.05 2.85,153.4 | 2.85,33.15 2.85,153.4 | X1.2 2.85,153.4
VDD_CURR_LIM
  Top 0.406: R10.1 LED5.A
VREF_2
  Top 0.406: U19.31 148.56,48.75 144.88,48.75 U19.13 138.76,47.65 C151.1 C10.+ 126.8,47.65 124.6,49.85 C150.1 124.19,50.06 U20.6
VSS  (via drill 0.35)
  Top 0.406: U19.12 141.05,53.5 C145.1 C26.- | v153,42.9 152.57,42.9 U19.29 | C26.- | C26.- v129.6,53.5
  Bottom 0.406: C25.- C147.1 v153,42.91 v153,42.9 | 120.5,57.85 108.8,57.85 104.9,53.95 104.9,38.35 101.65,35.1 10.65,35.1 6.75,39 6.75,145.6 10.65,149.5 10.65,170.95 13.9,174.2 92.55,174.2 95.8,170.95 95.8,165.85 PL1.14 | 120.5,57.85 128.95,57.85 129.6,57.2 v129.6,53.5 140.2,42.9 v153,42.9 | v153,42.9 | C16.- 120.5,57.85

## Text on the board
tNames: +5V | +3.3V | PWR_GOOD | +12V | ON | OFF | Heartbeat | Digital IO | Serial | IO | GND | G/R/T | PWM | PWM | PWM | PWM | PWM | PWM | PWM | CAN RX | CAN TX | Controller Board / Hitzmann 2020